# EasyEDA schematic SCH_FSAE_PUPR_EVA34_2026-05-27.json

## Sheets
1 Connector: TITLE: Sheet_1; REV: 1.0; Date: 2025-11-17; Sheet: 1/1; Drawn By: Norman Alphaspeed; Company: Your Company
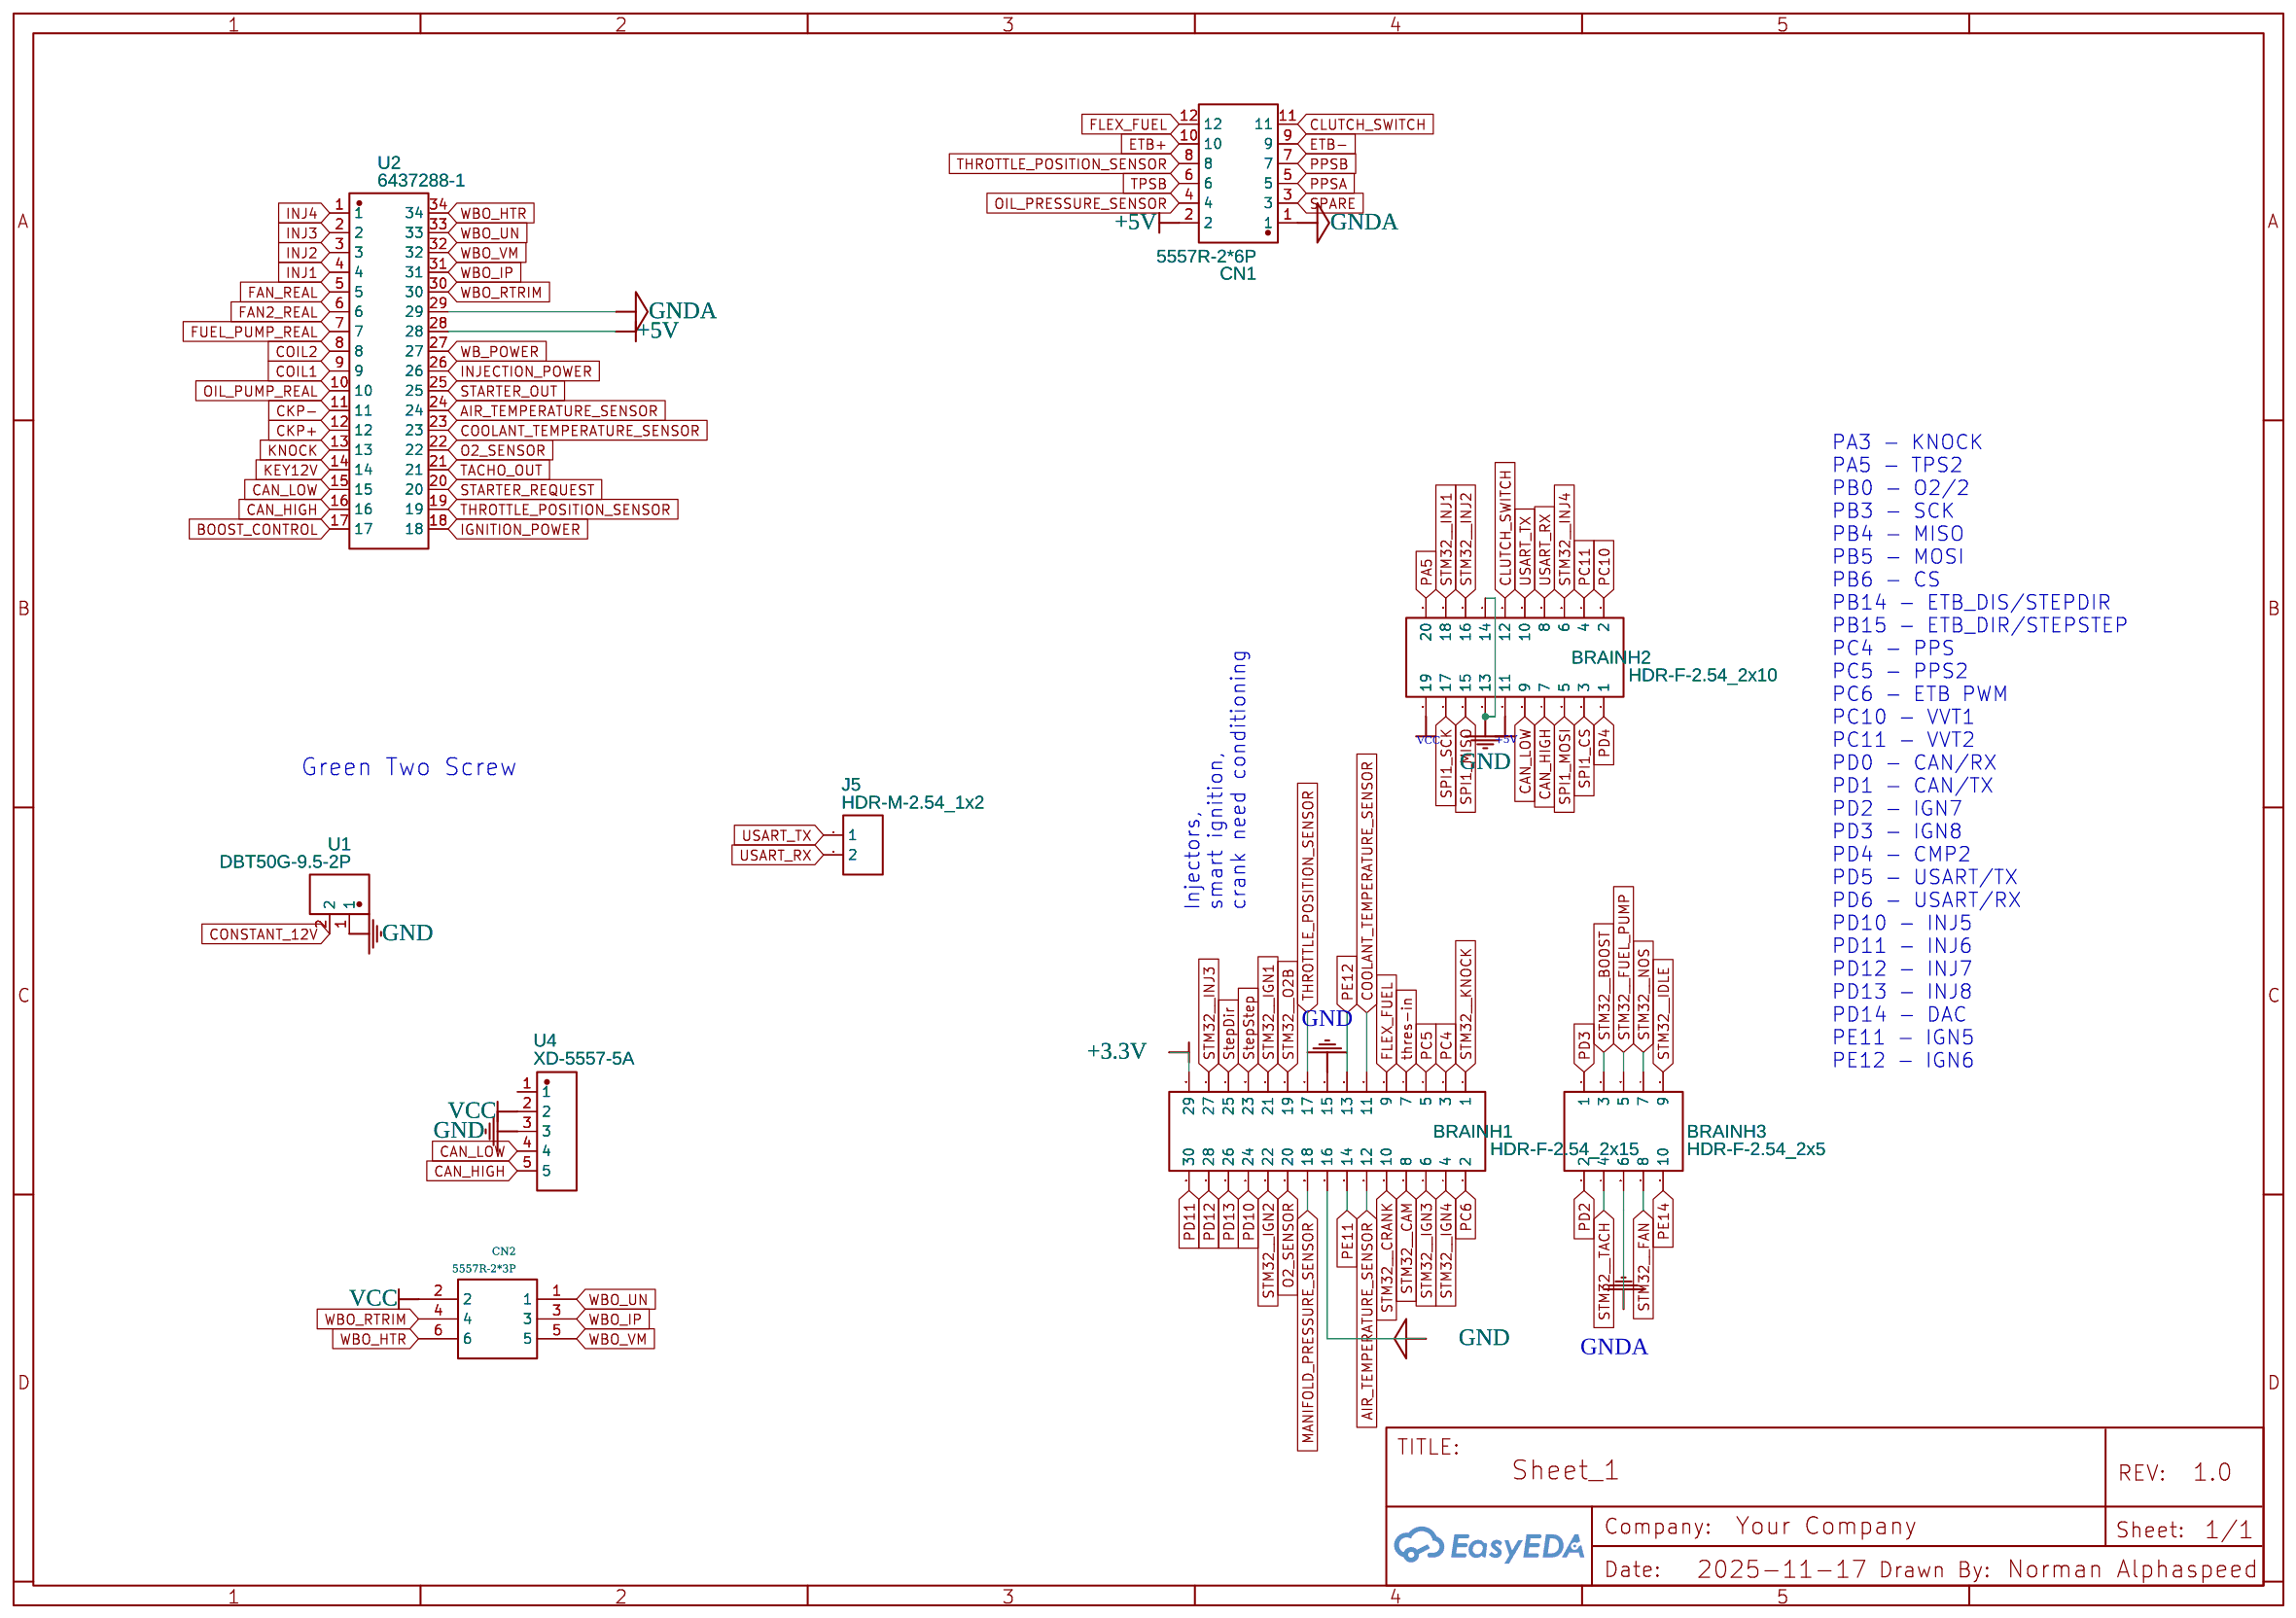
[diagram p0: Connector]
2 Onboard Relays: Date: 2025-11-18
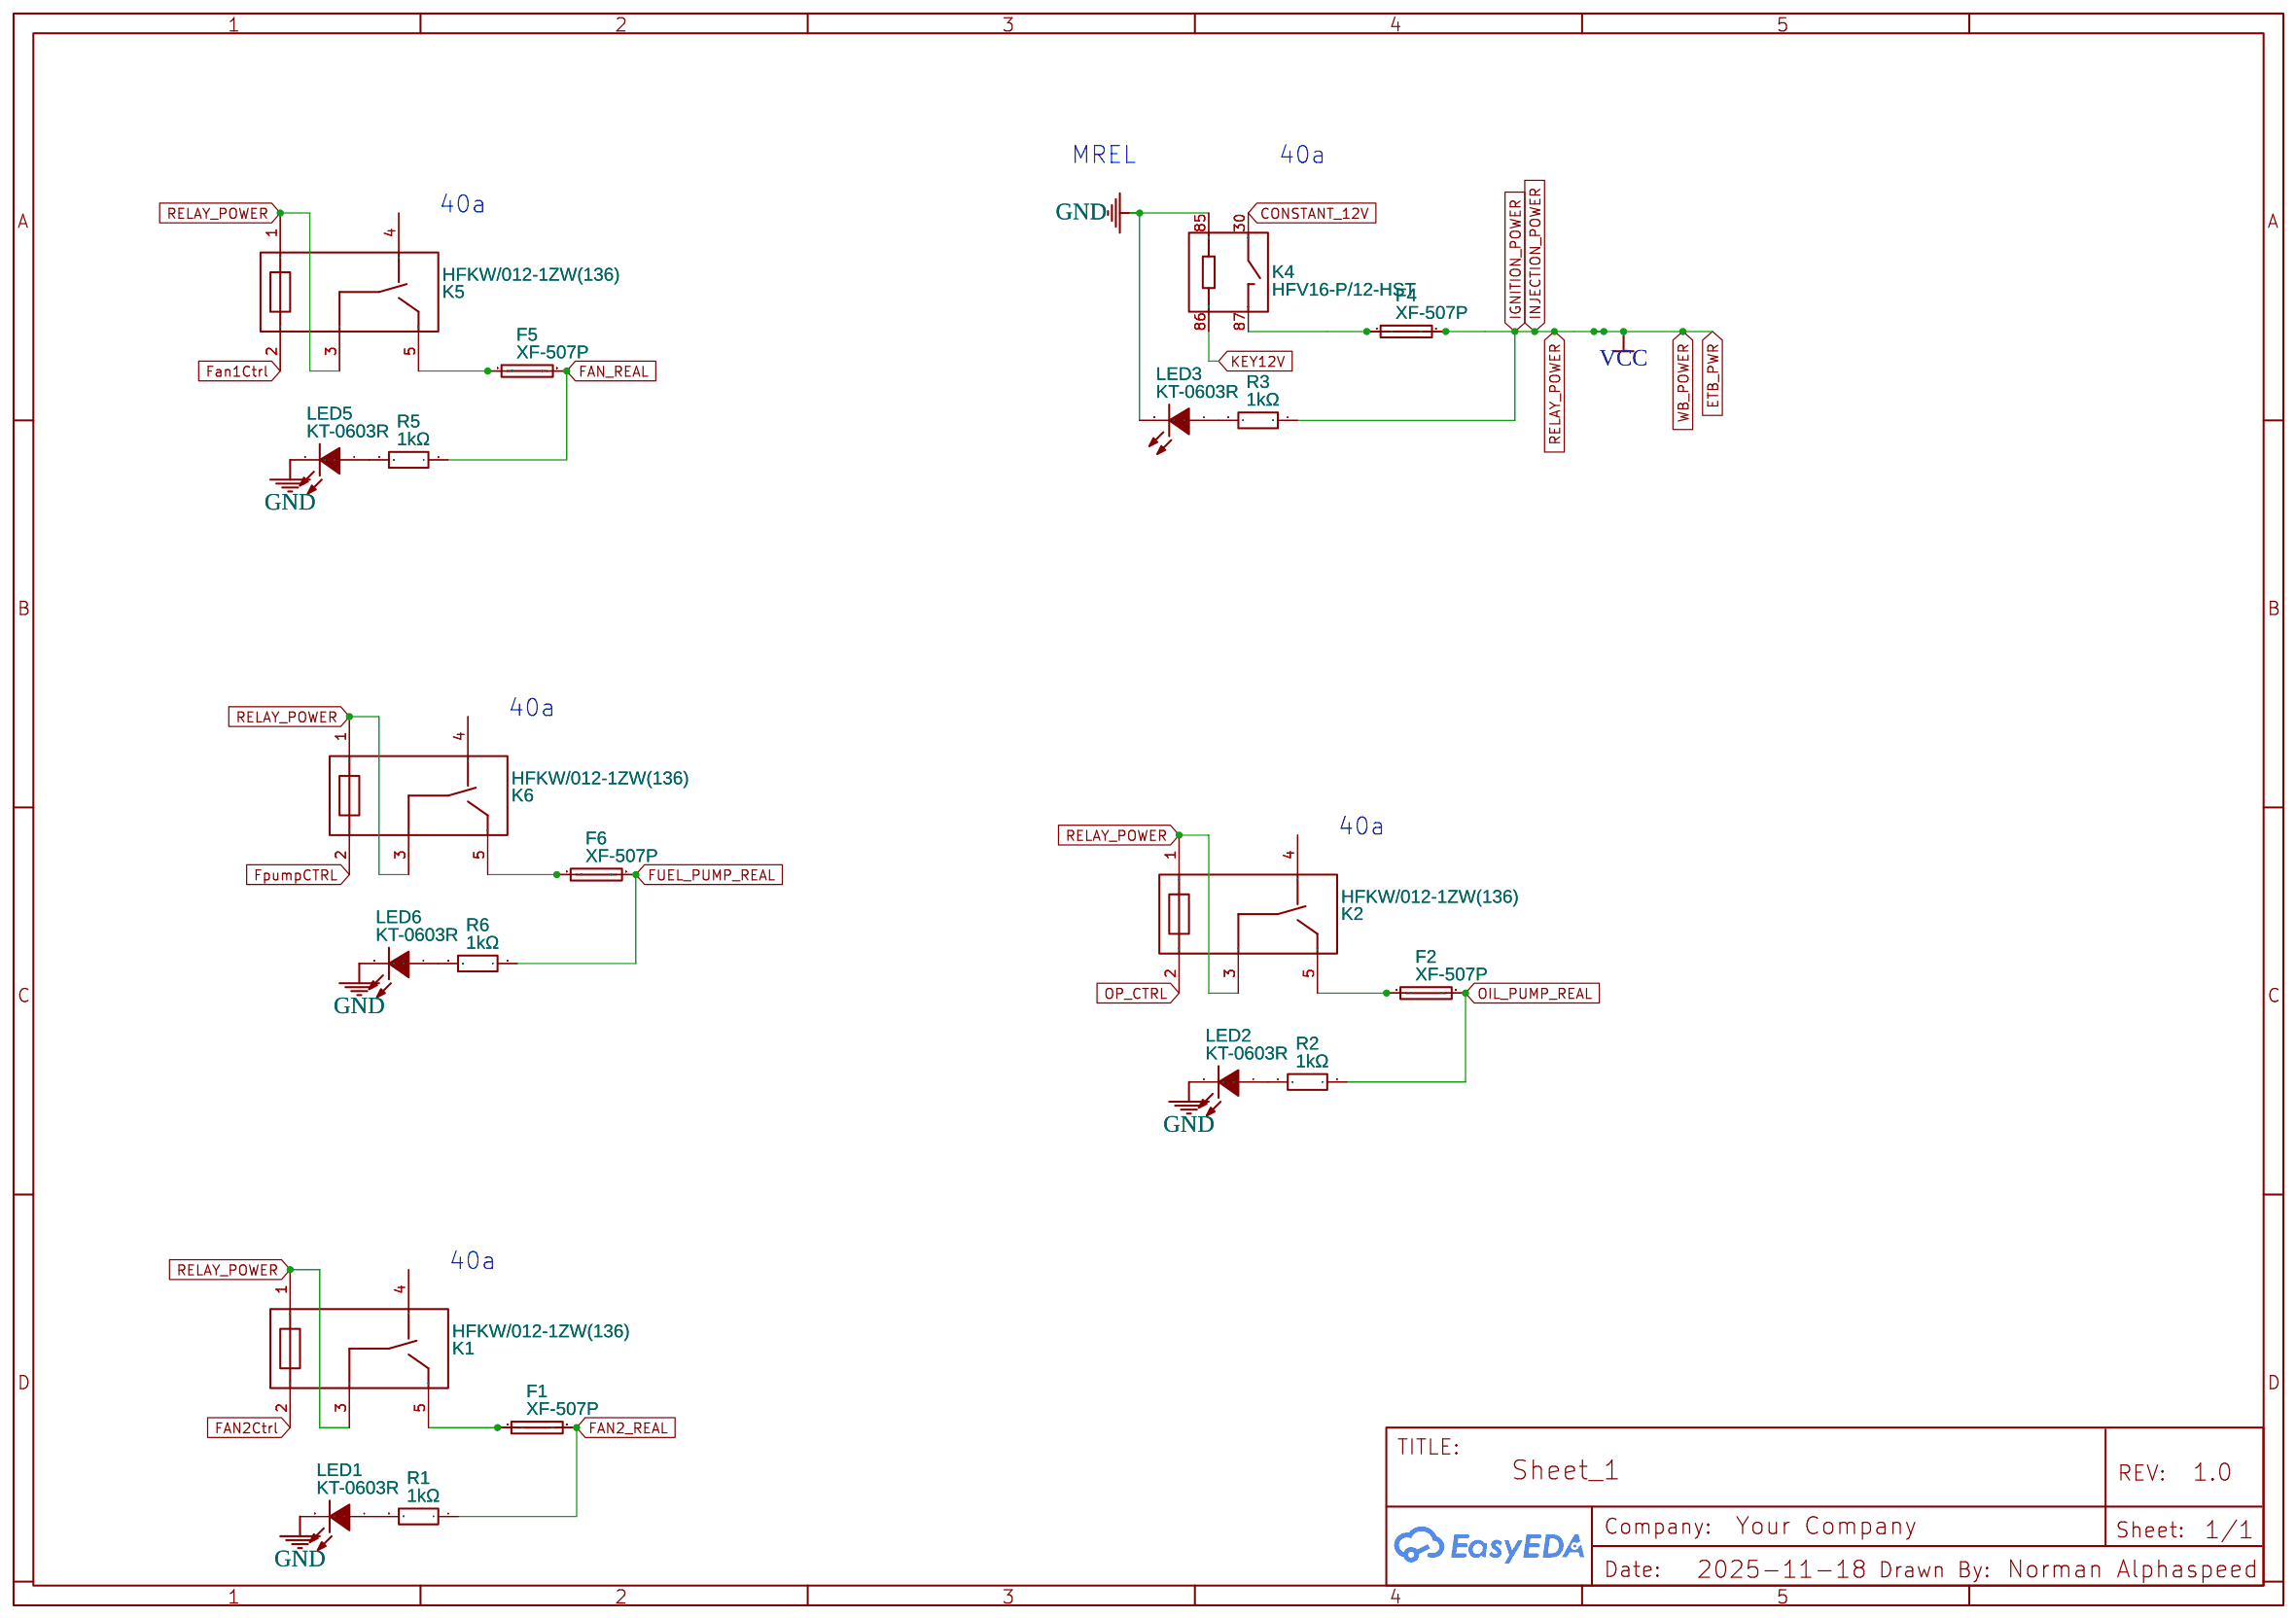
[diagram p1: Onboard Relays]
3 Coils: Date: 2025-11-18
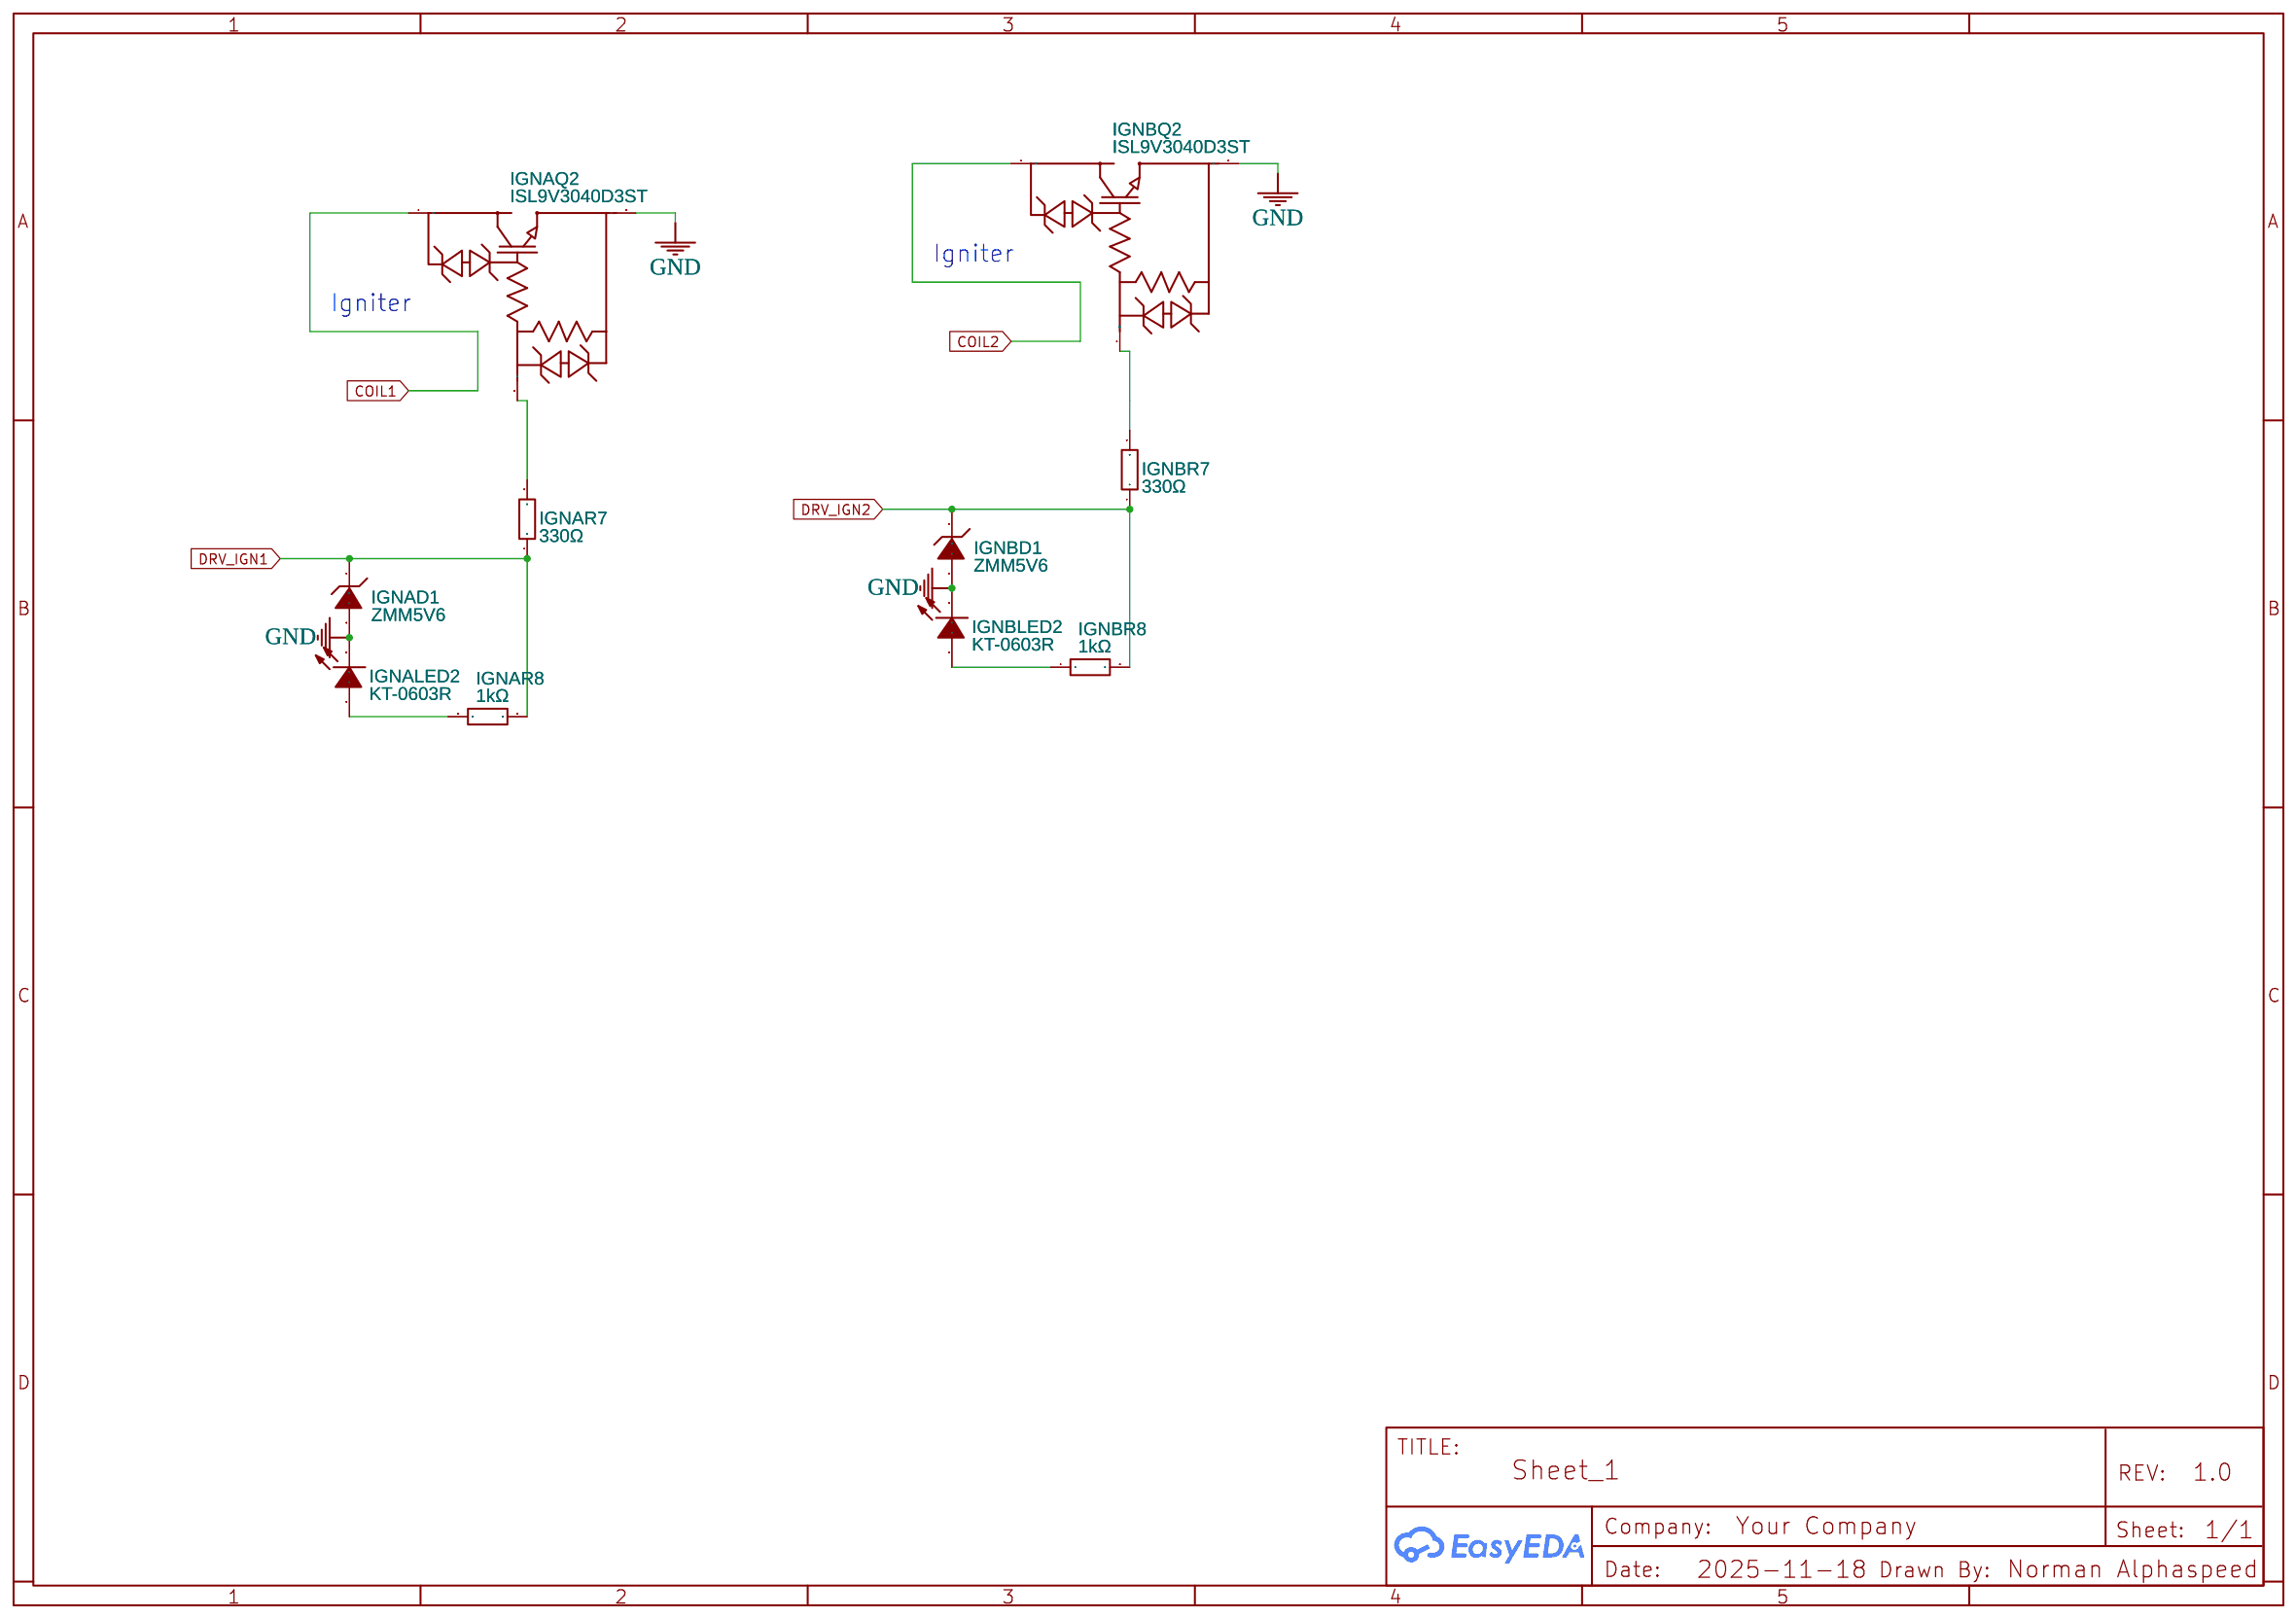
[diagram p2: Coils]
4 Injectors: Date: 2025-11-18
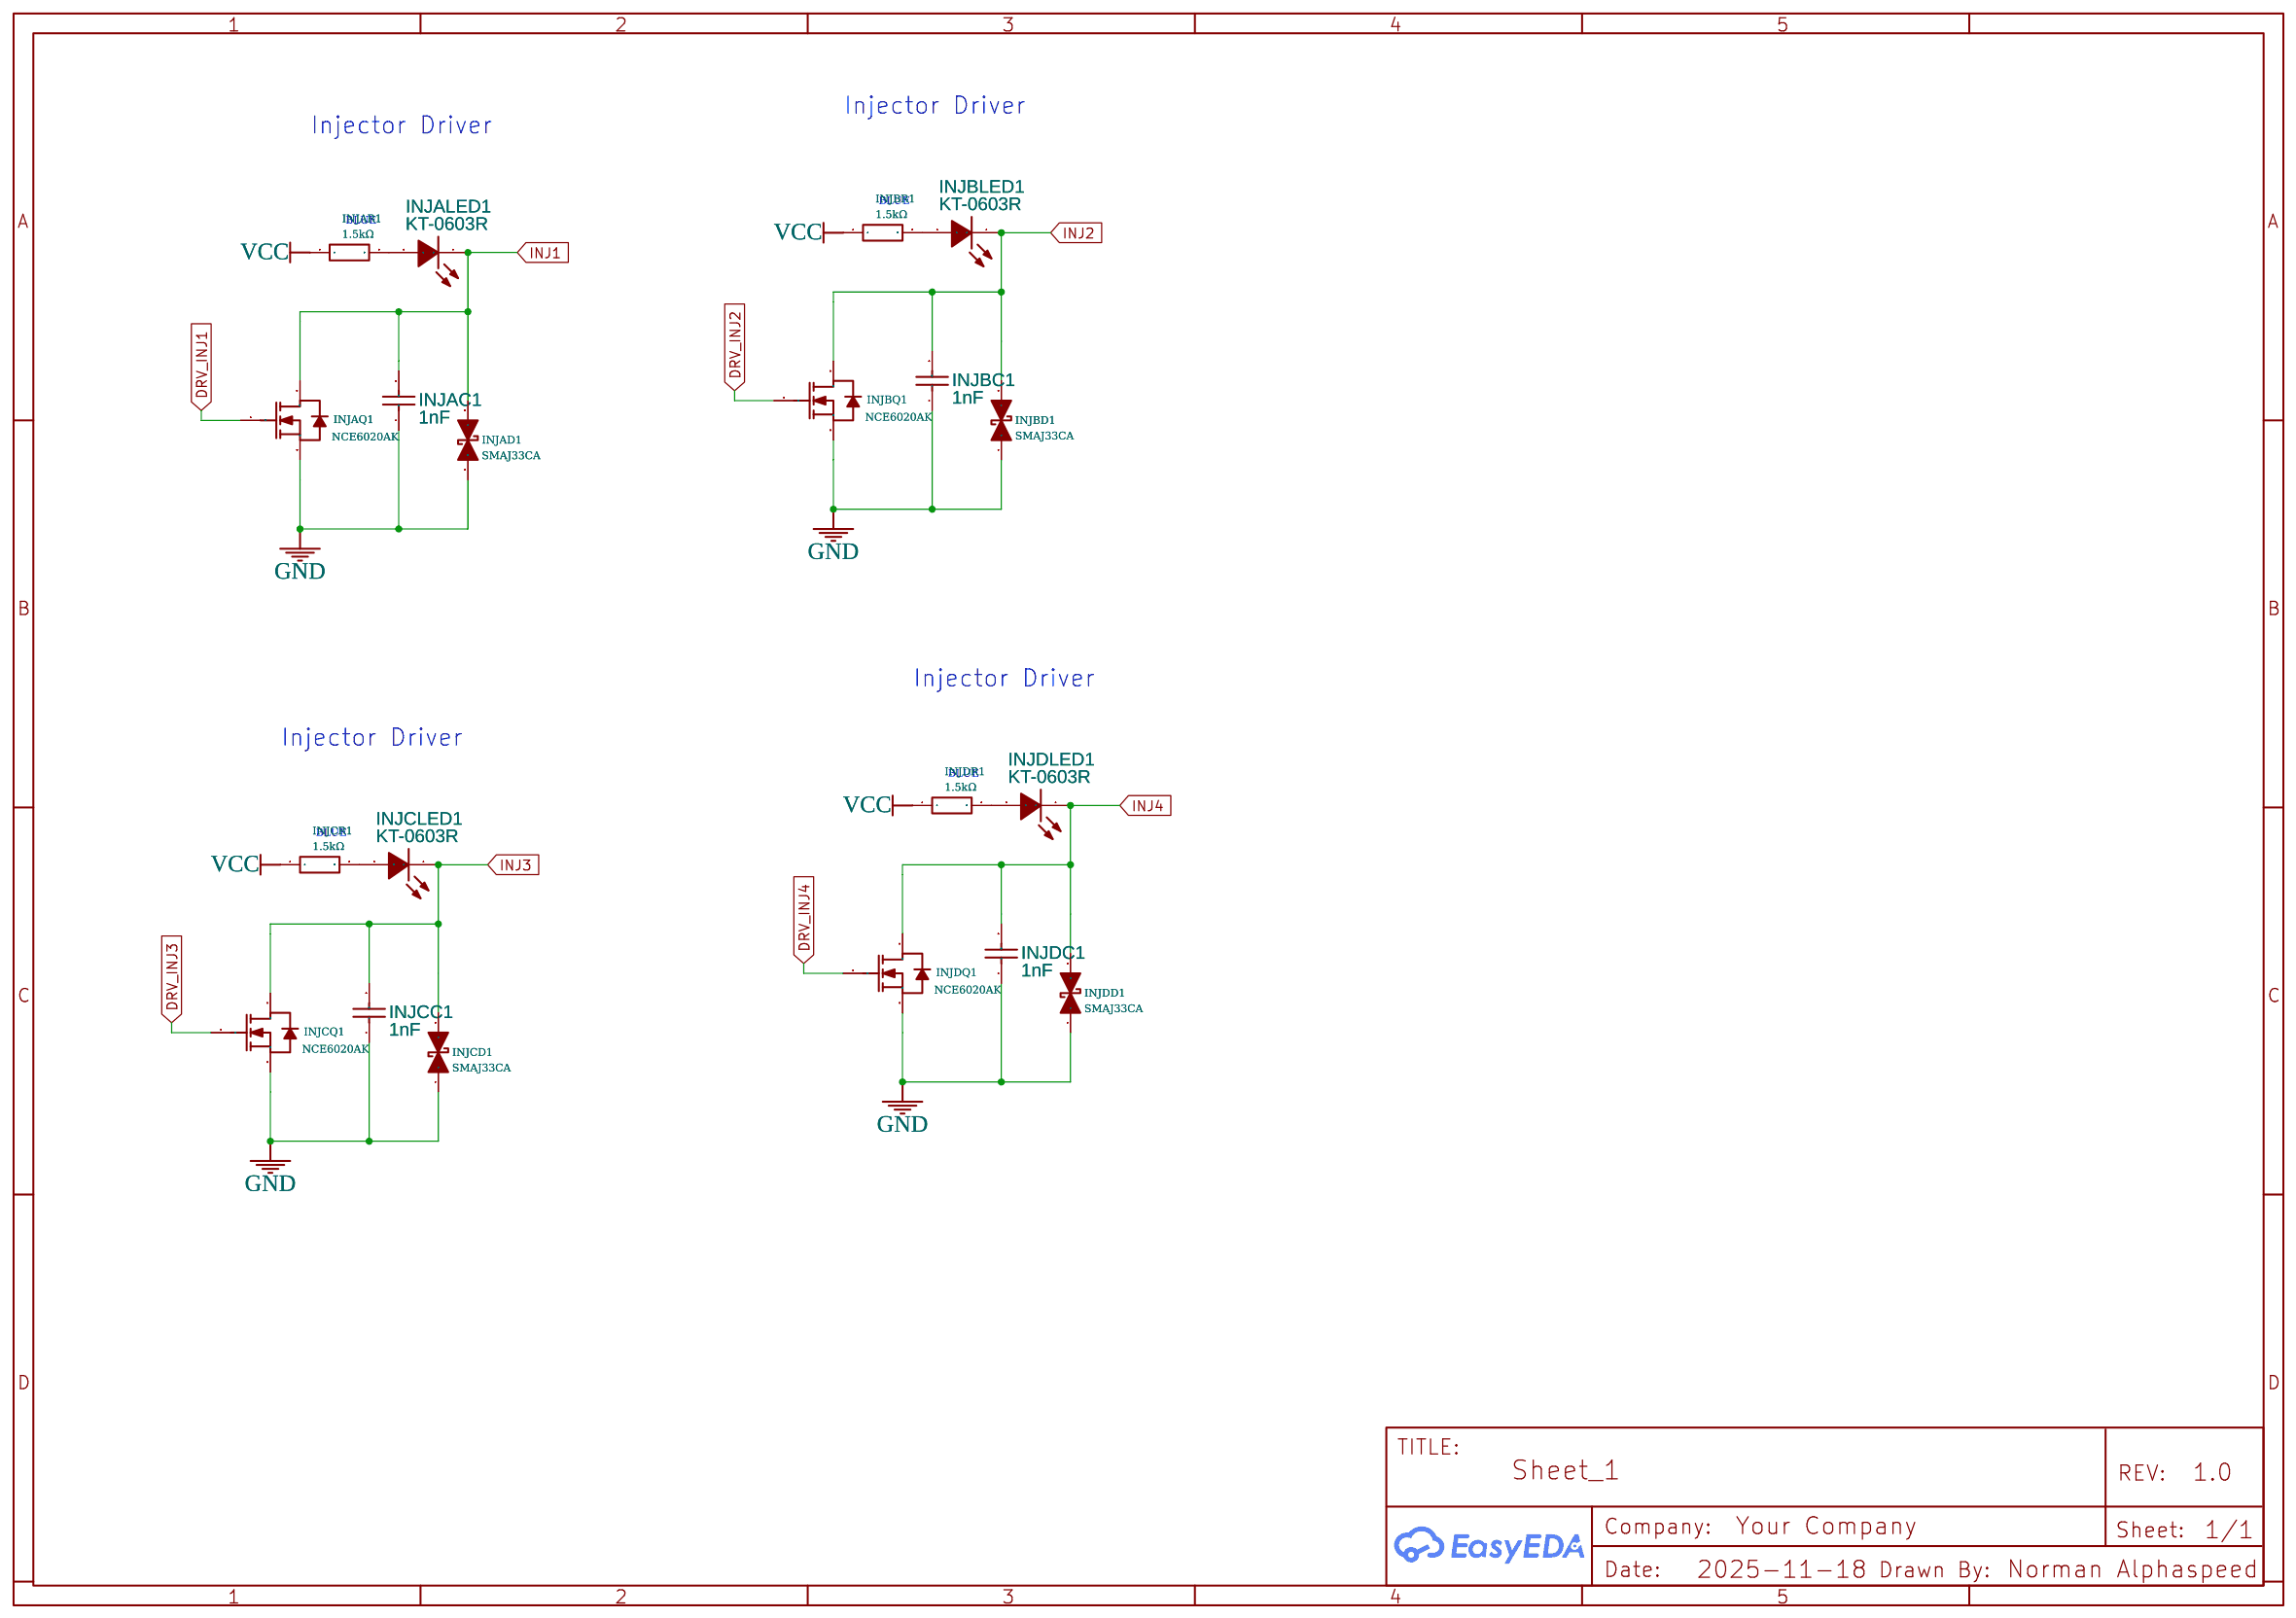
[diagram p3: Injectors]
5 Digital: Date: 2025-11-20
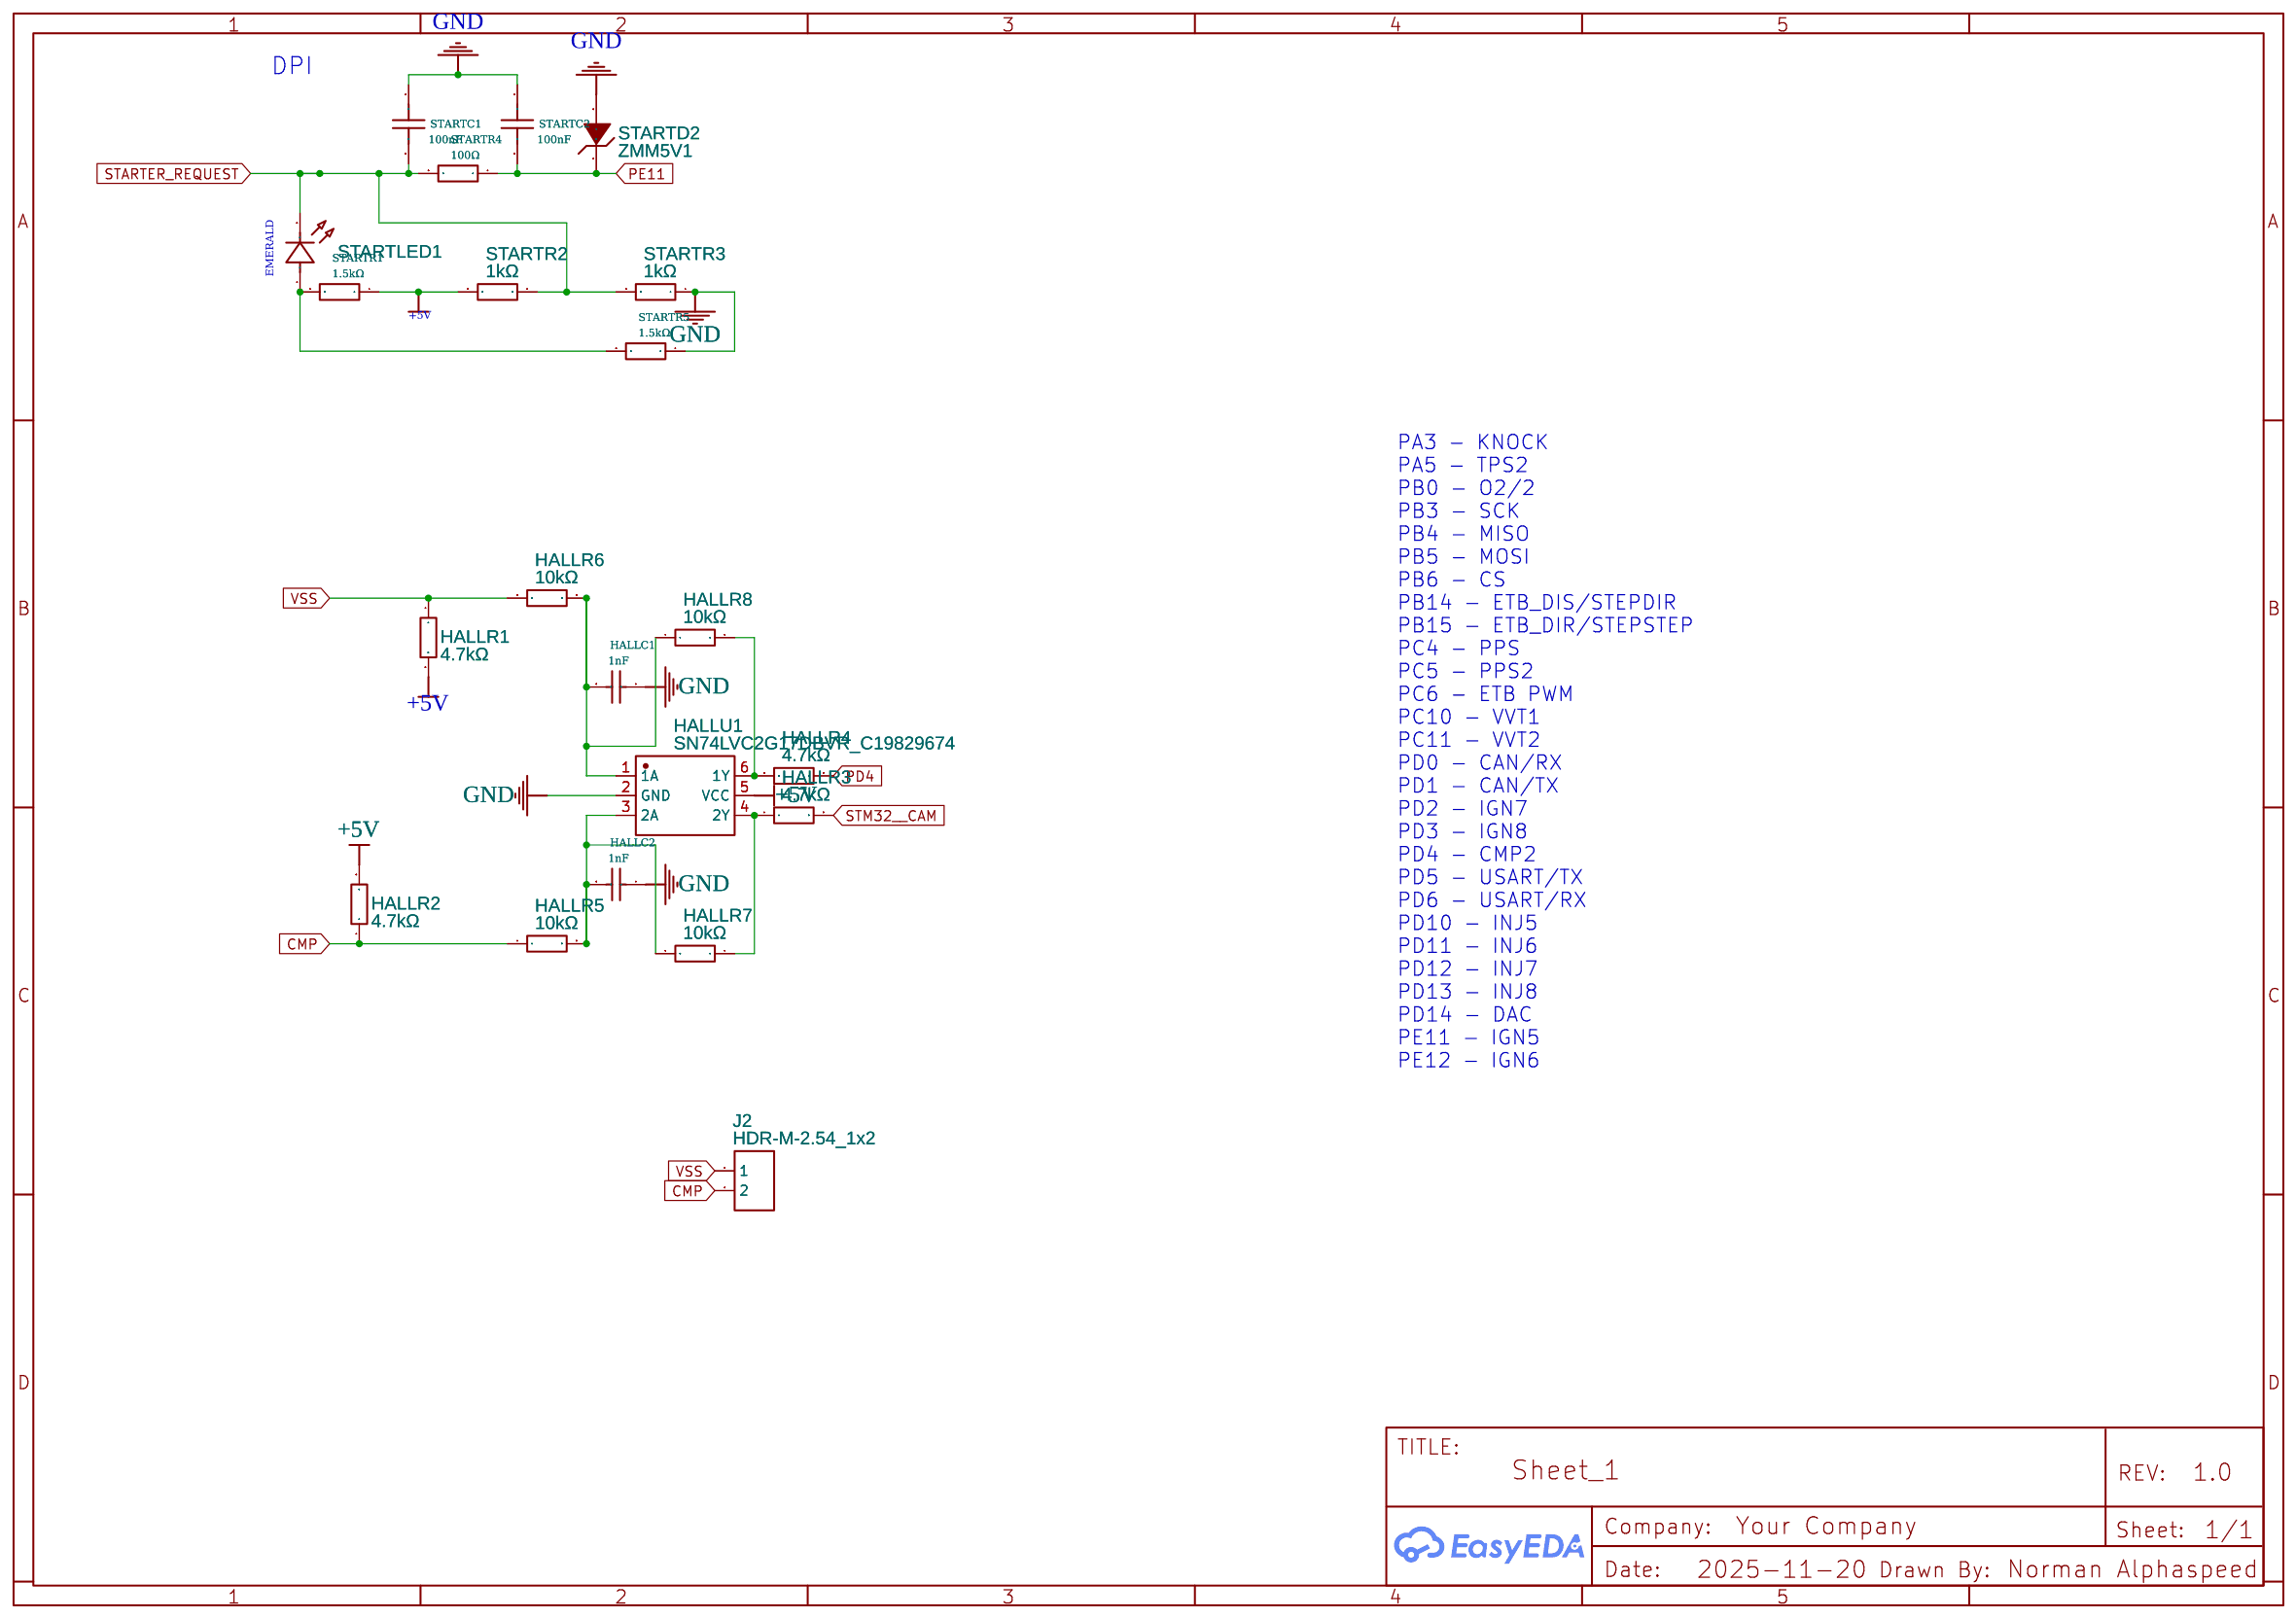
[diagram p4: Digital]
6 Outputs: TITLE: Sheet_2; Date: 2025-11-20
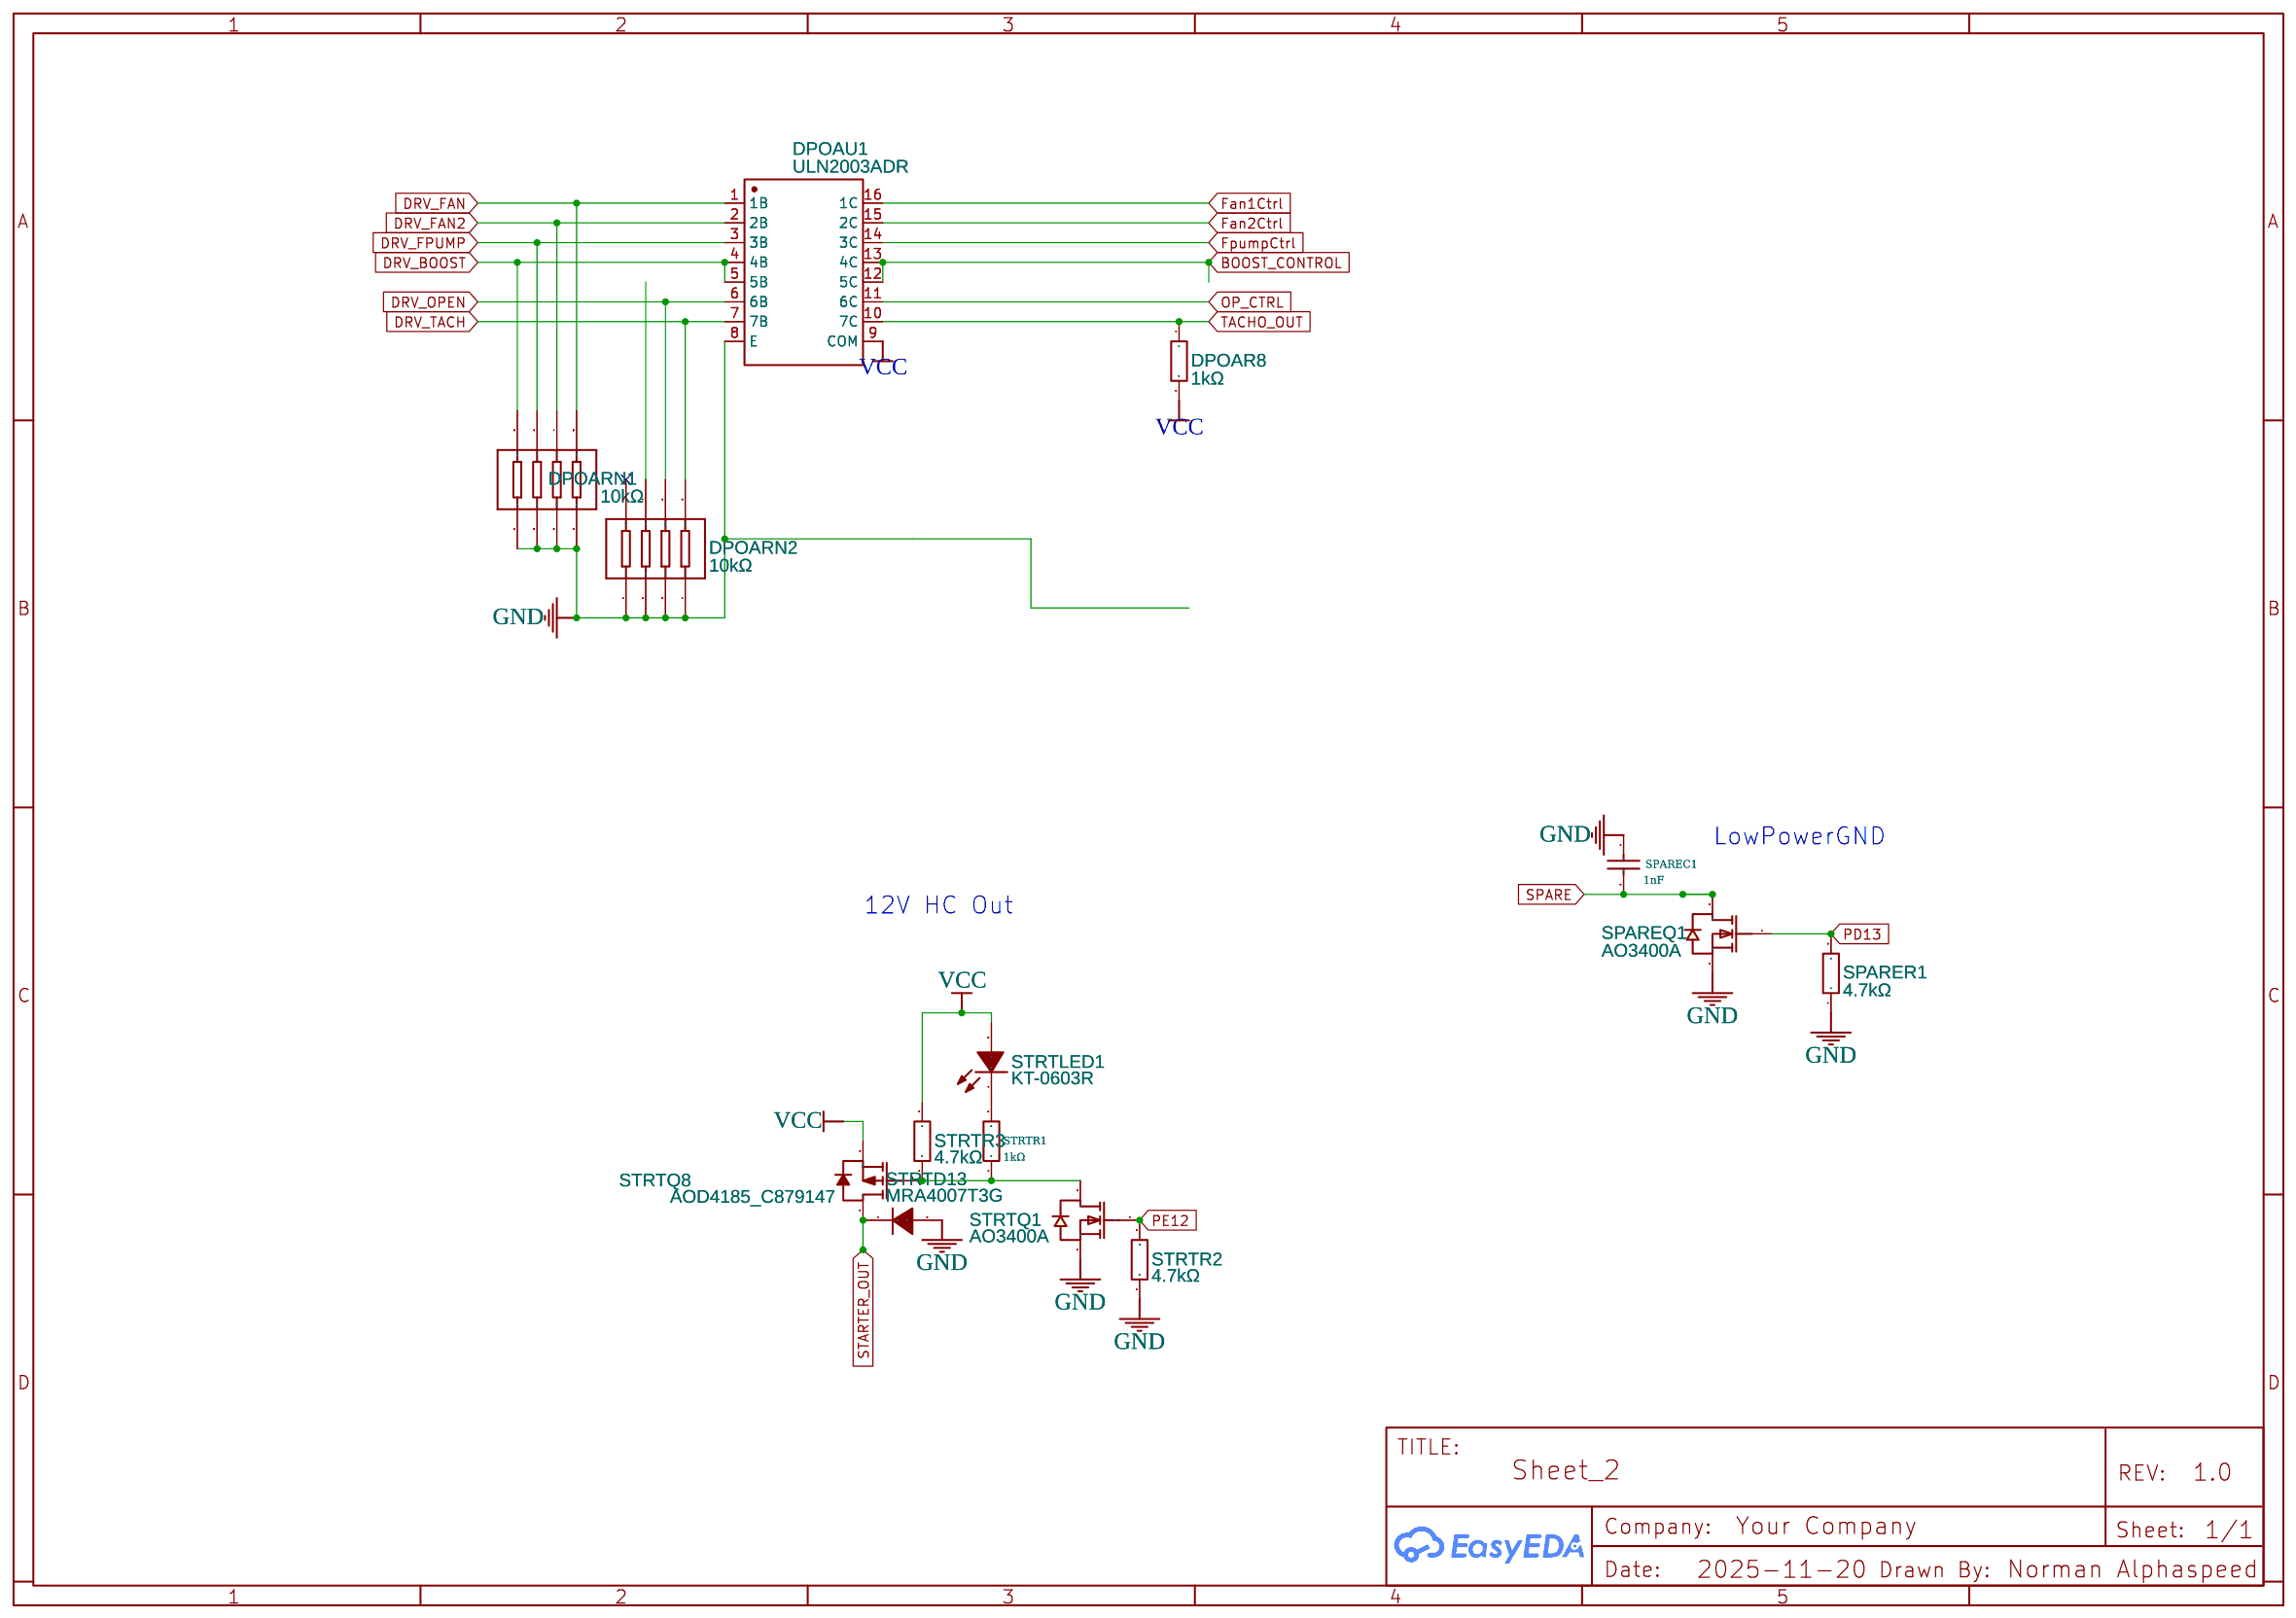
[diagram p5: Outputs]
7 Analog: Date: 2025-11-20
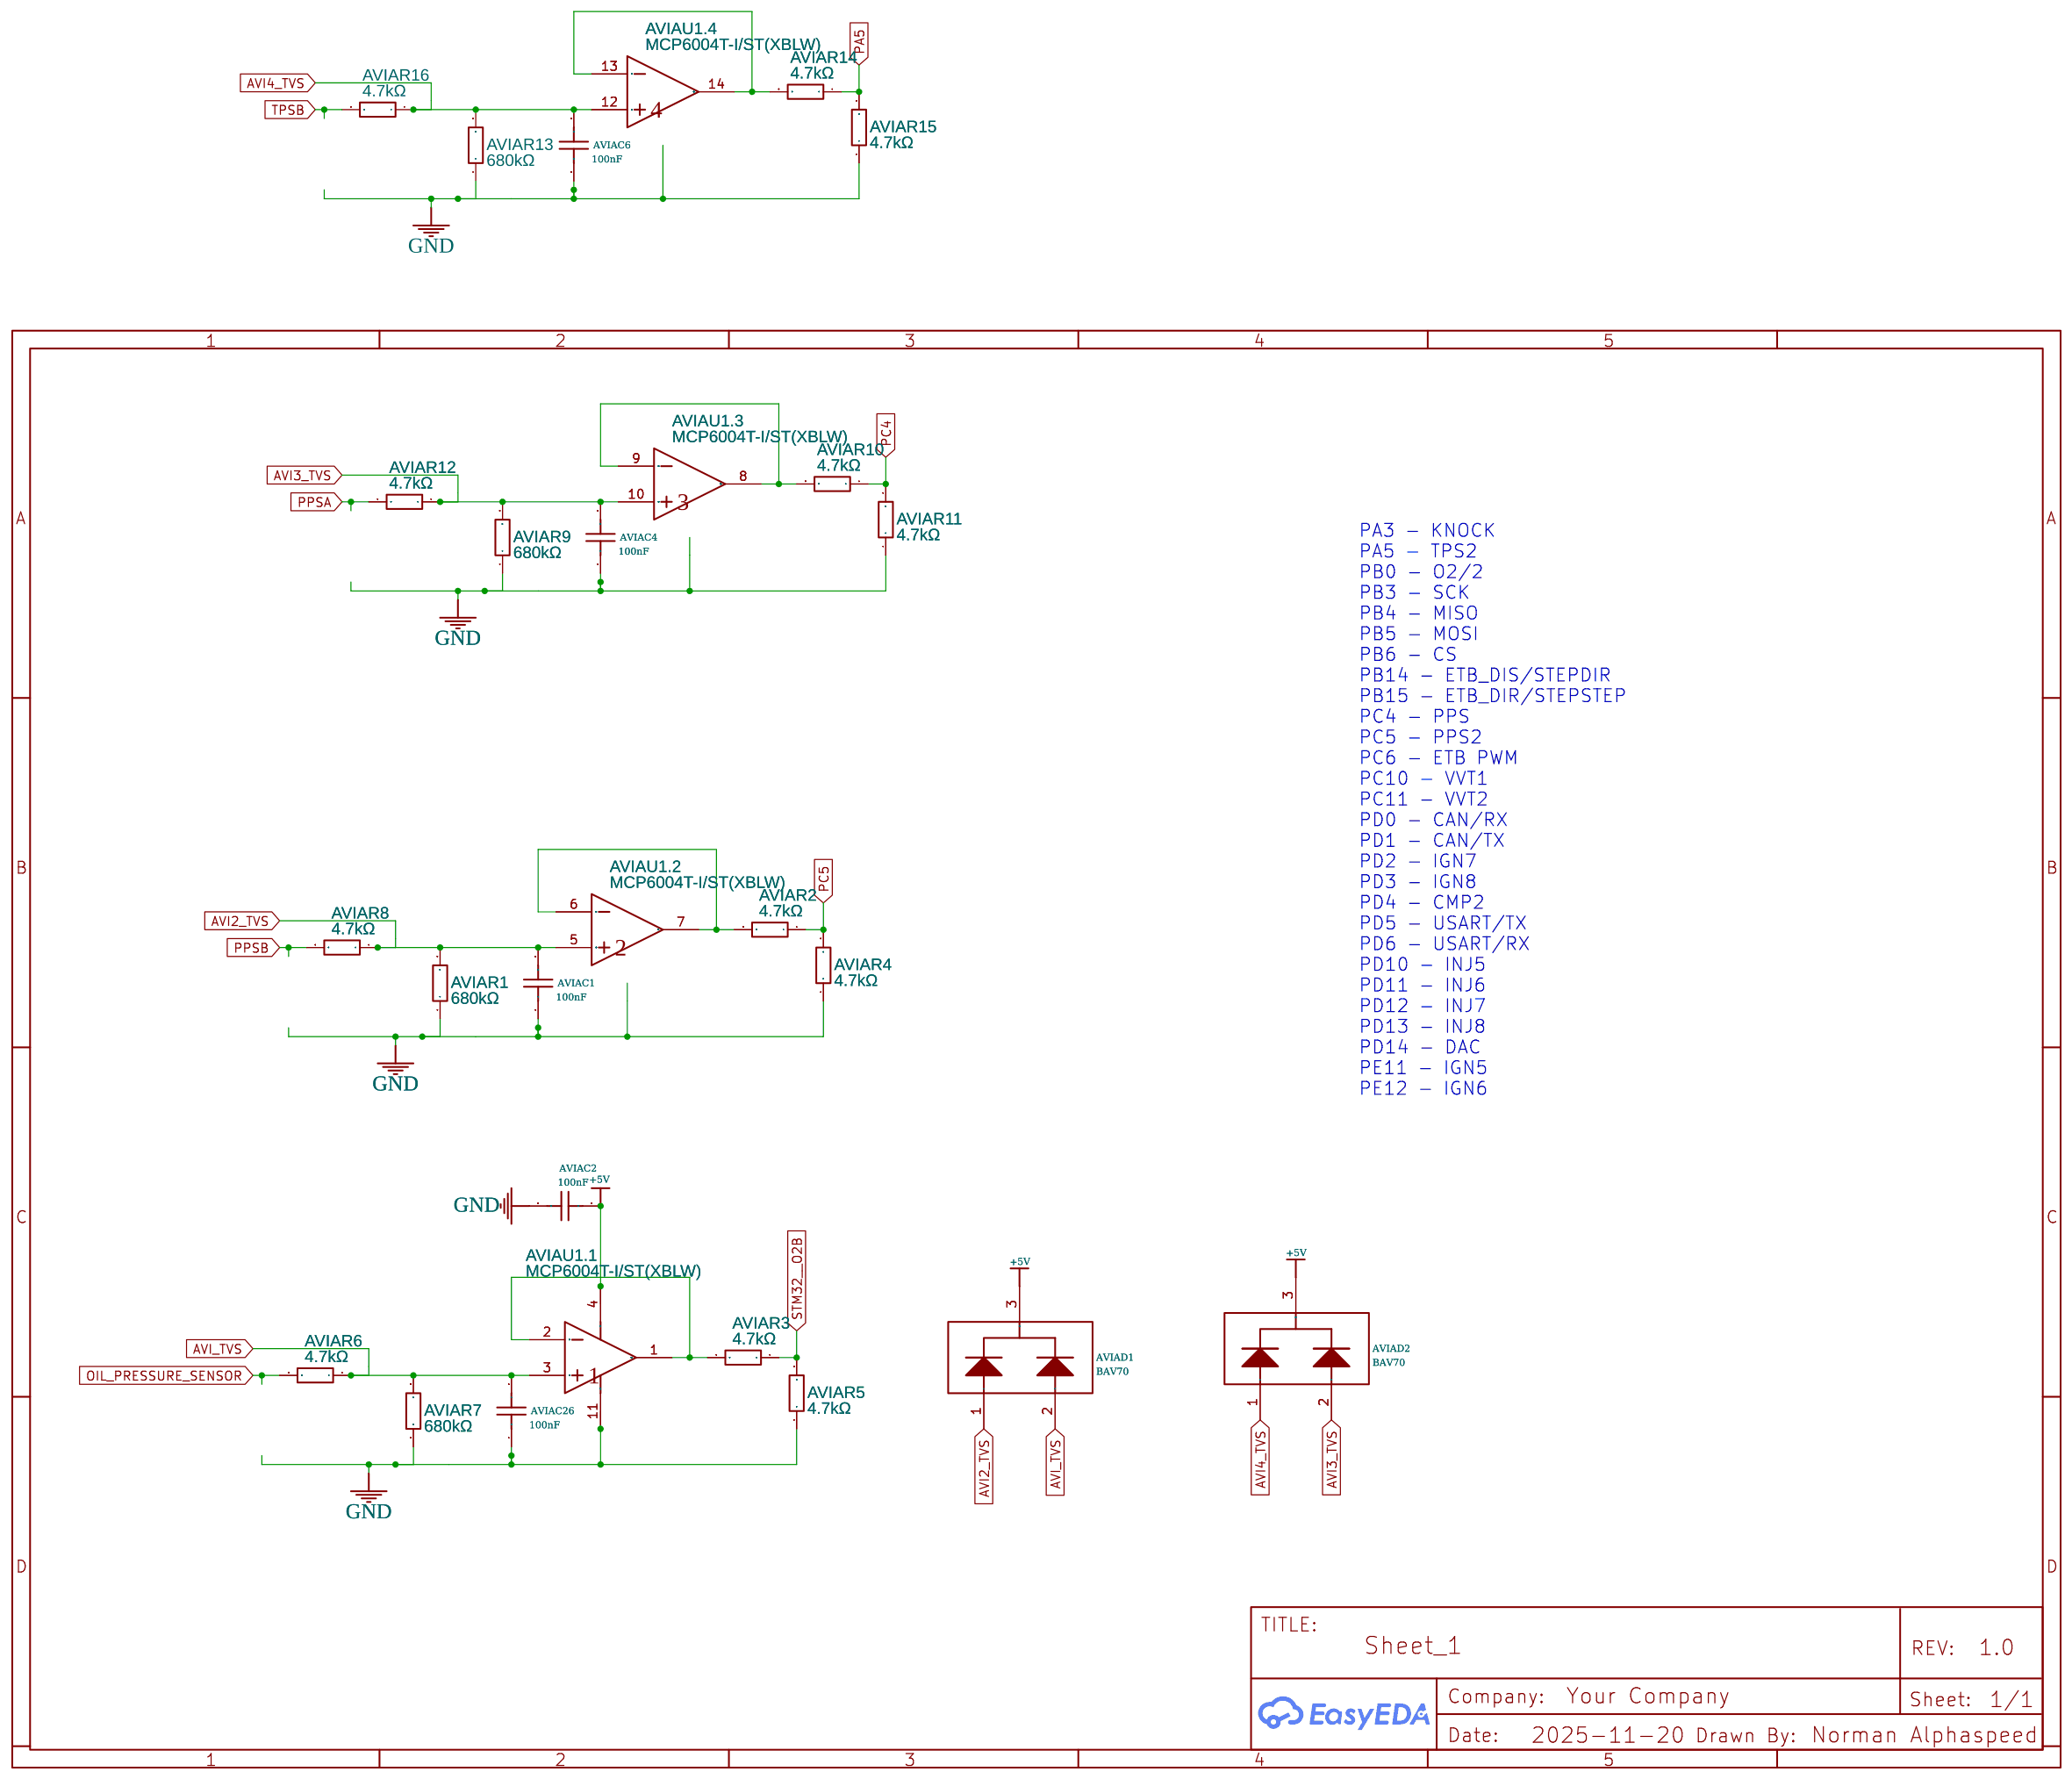
[diagram p6: Analog]
8 Driver: TITLE: Sheet_2; Date: 2025-11-20
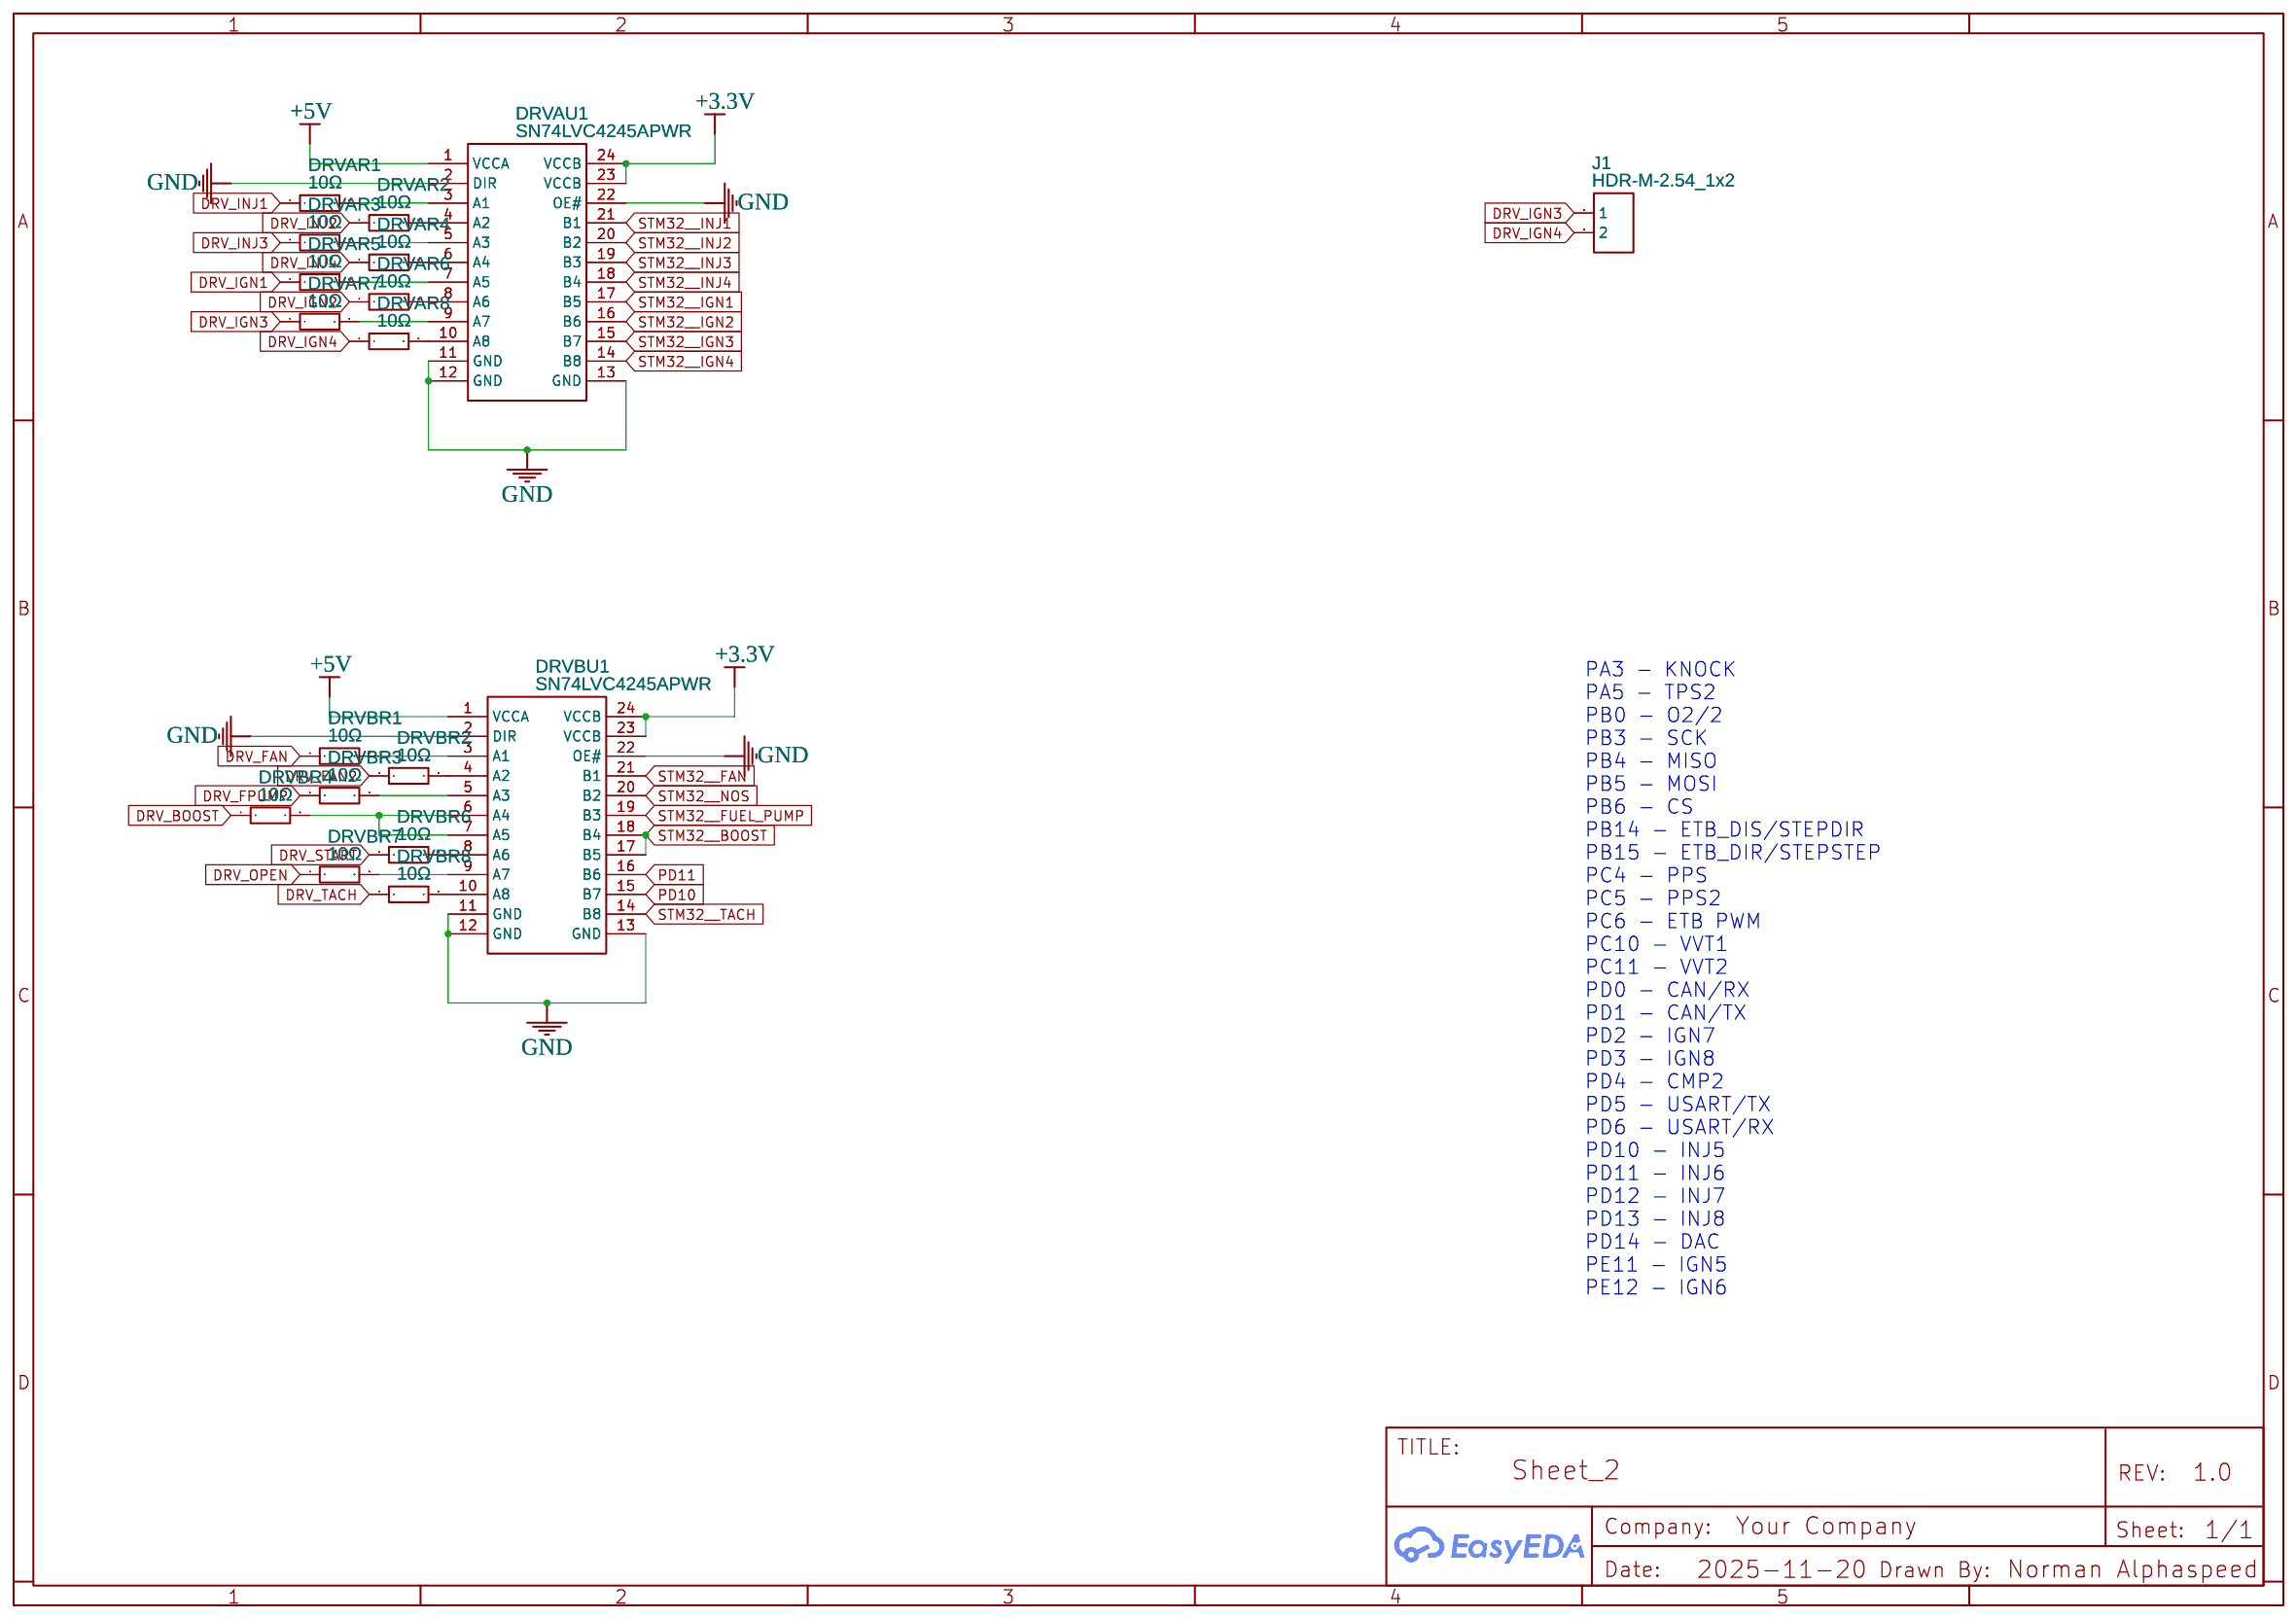
[diagram p7: Driver]
9 CKP: Date: 2025-11-20
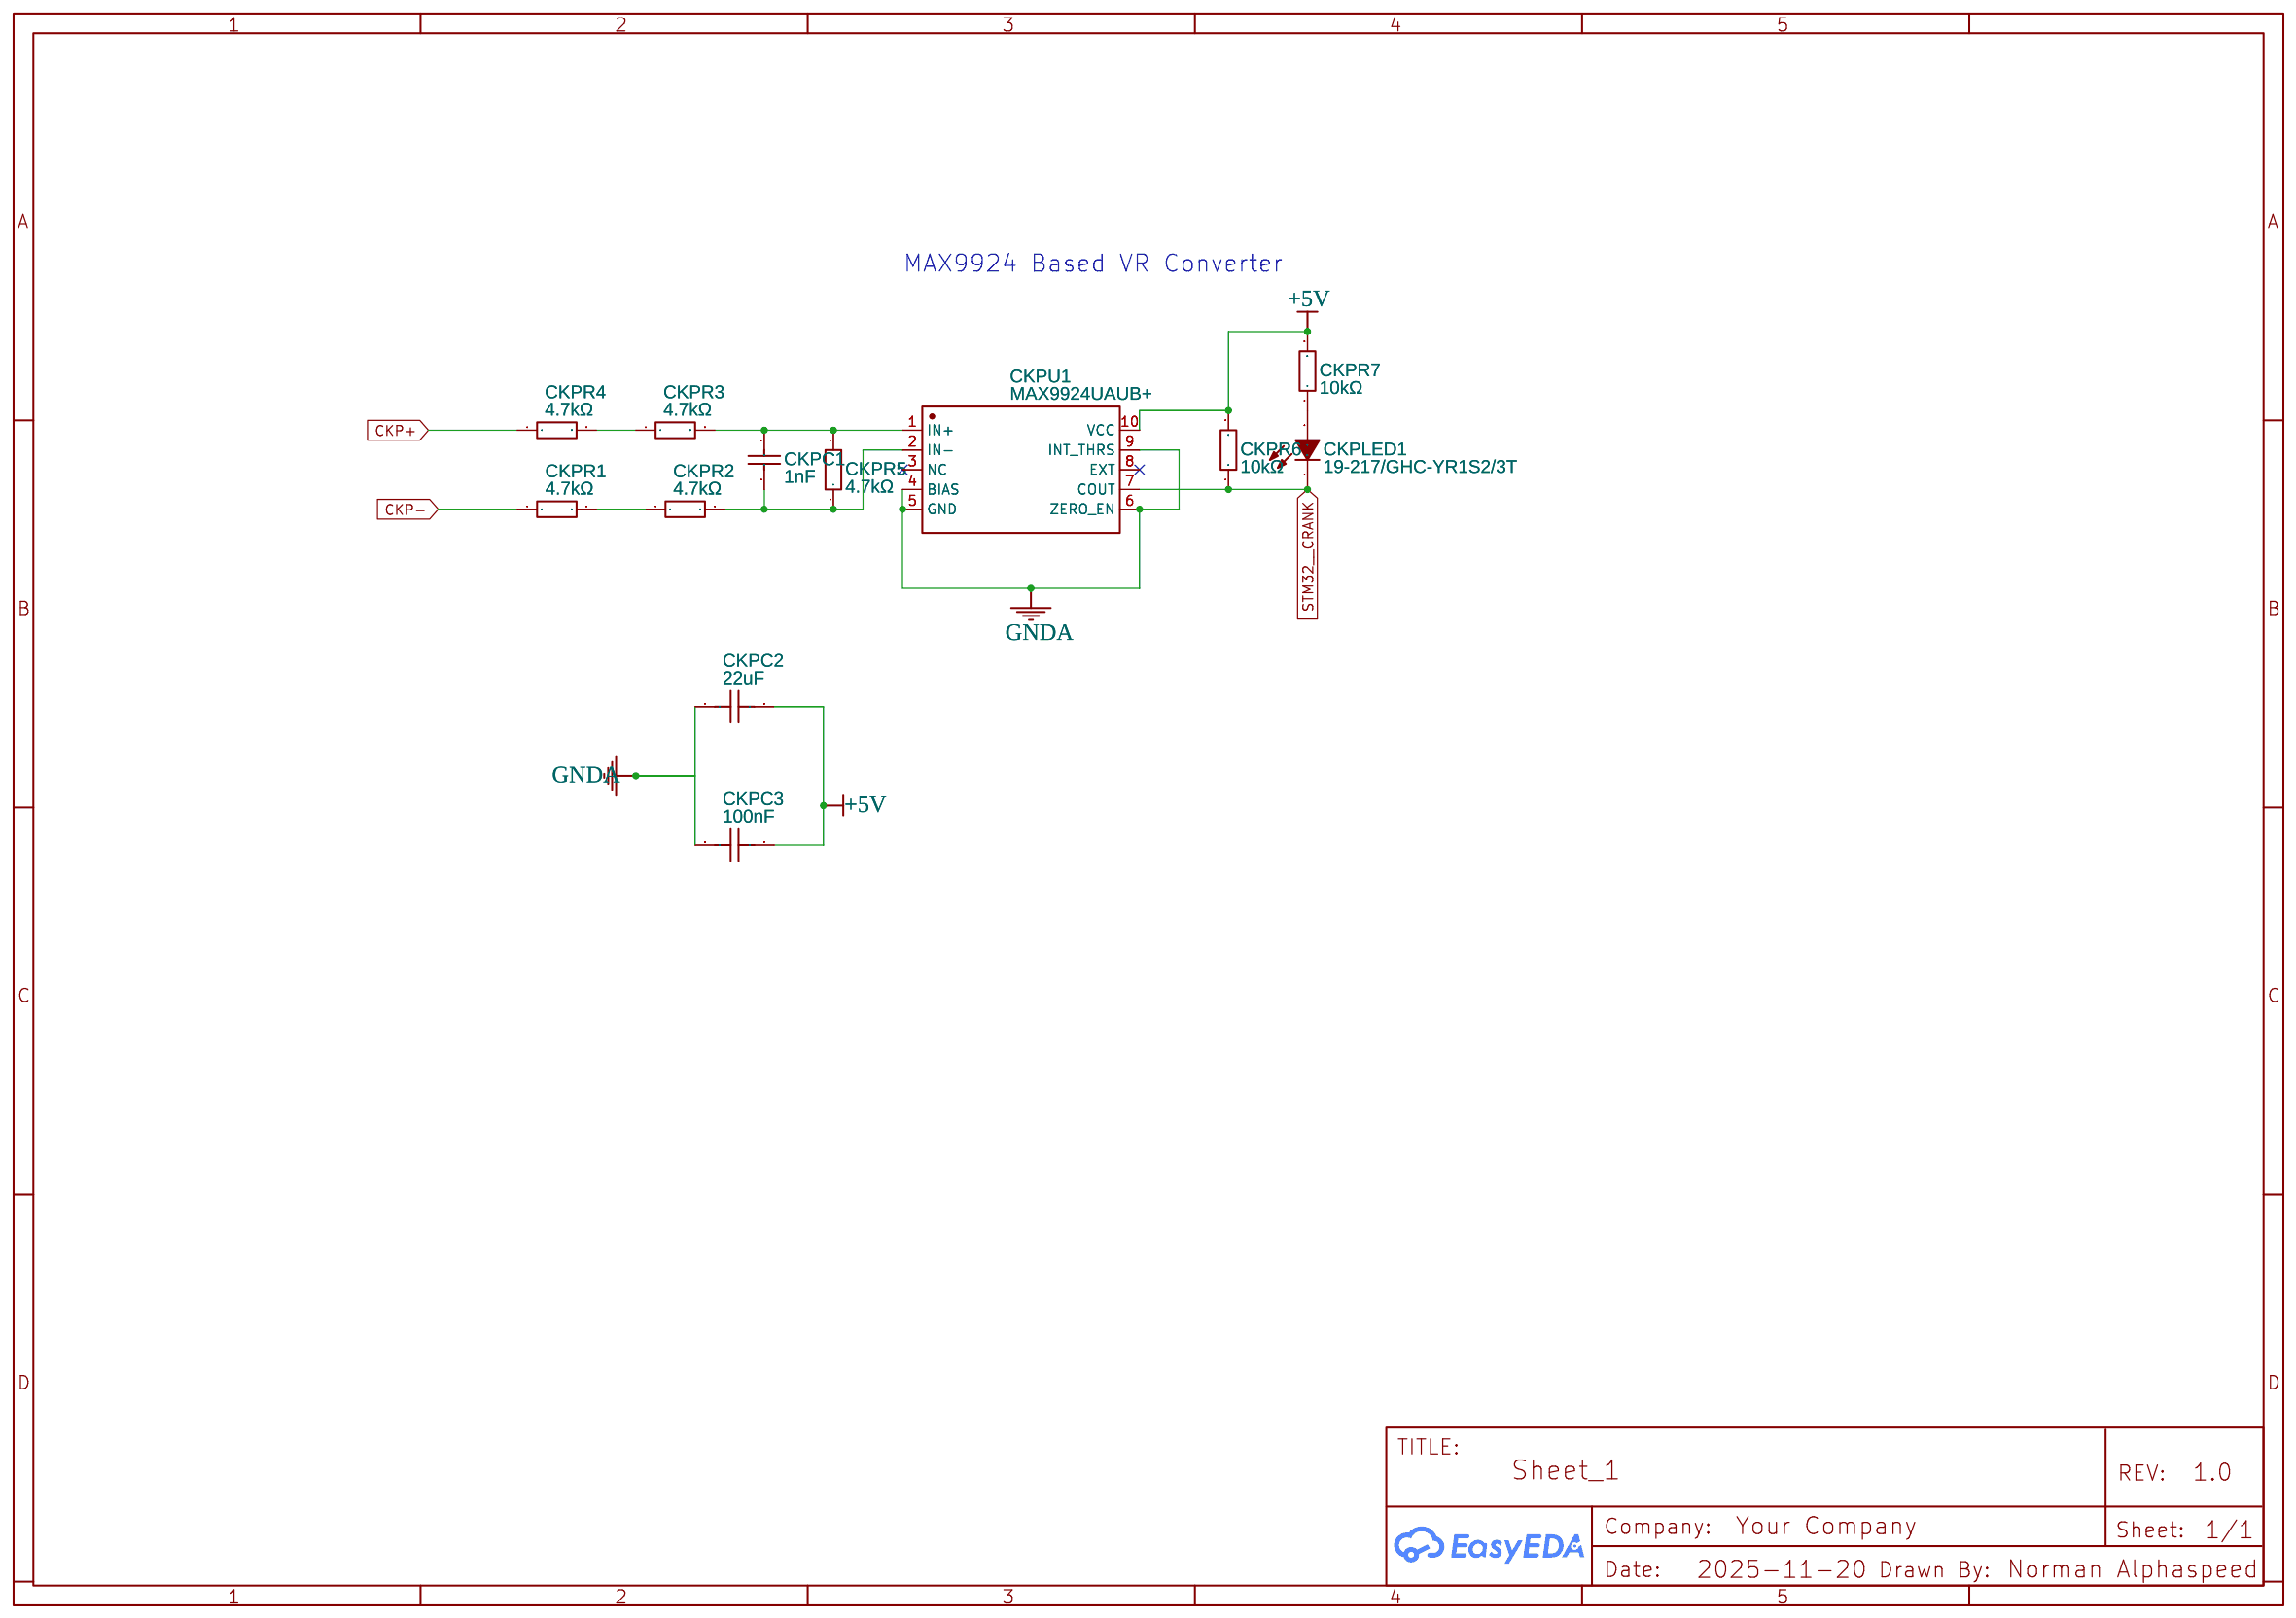
[diagram p8: CKP]
10 MAP: Date: 2025-11-20
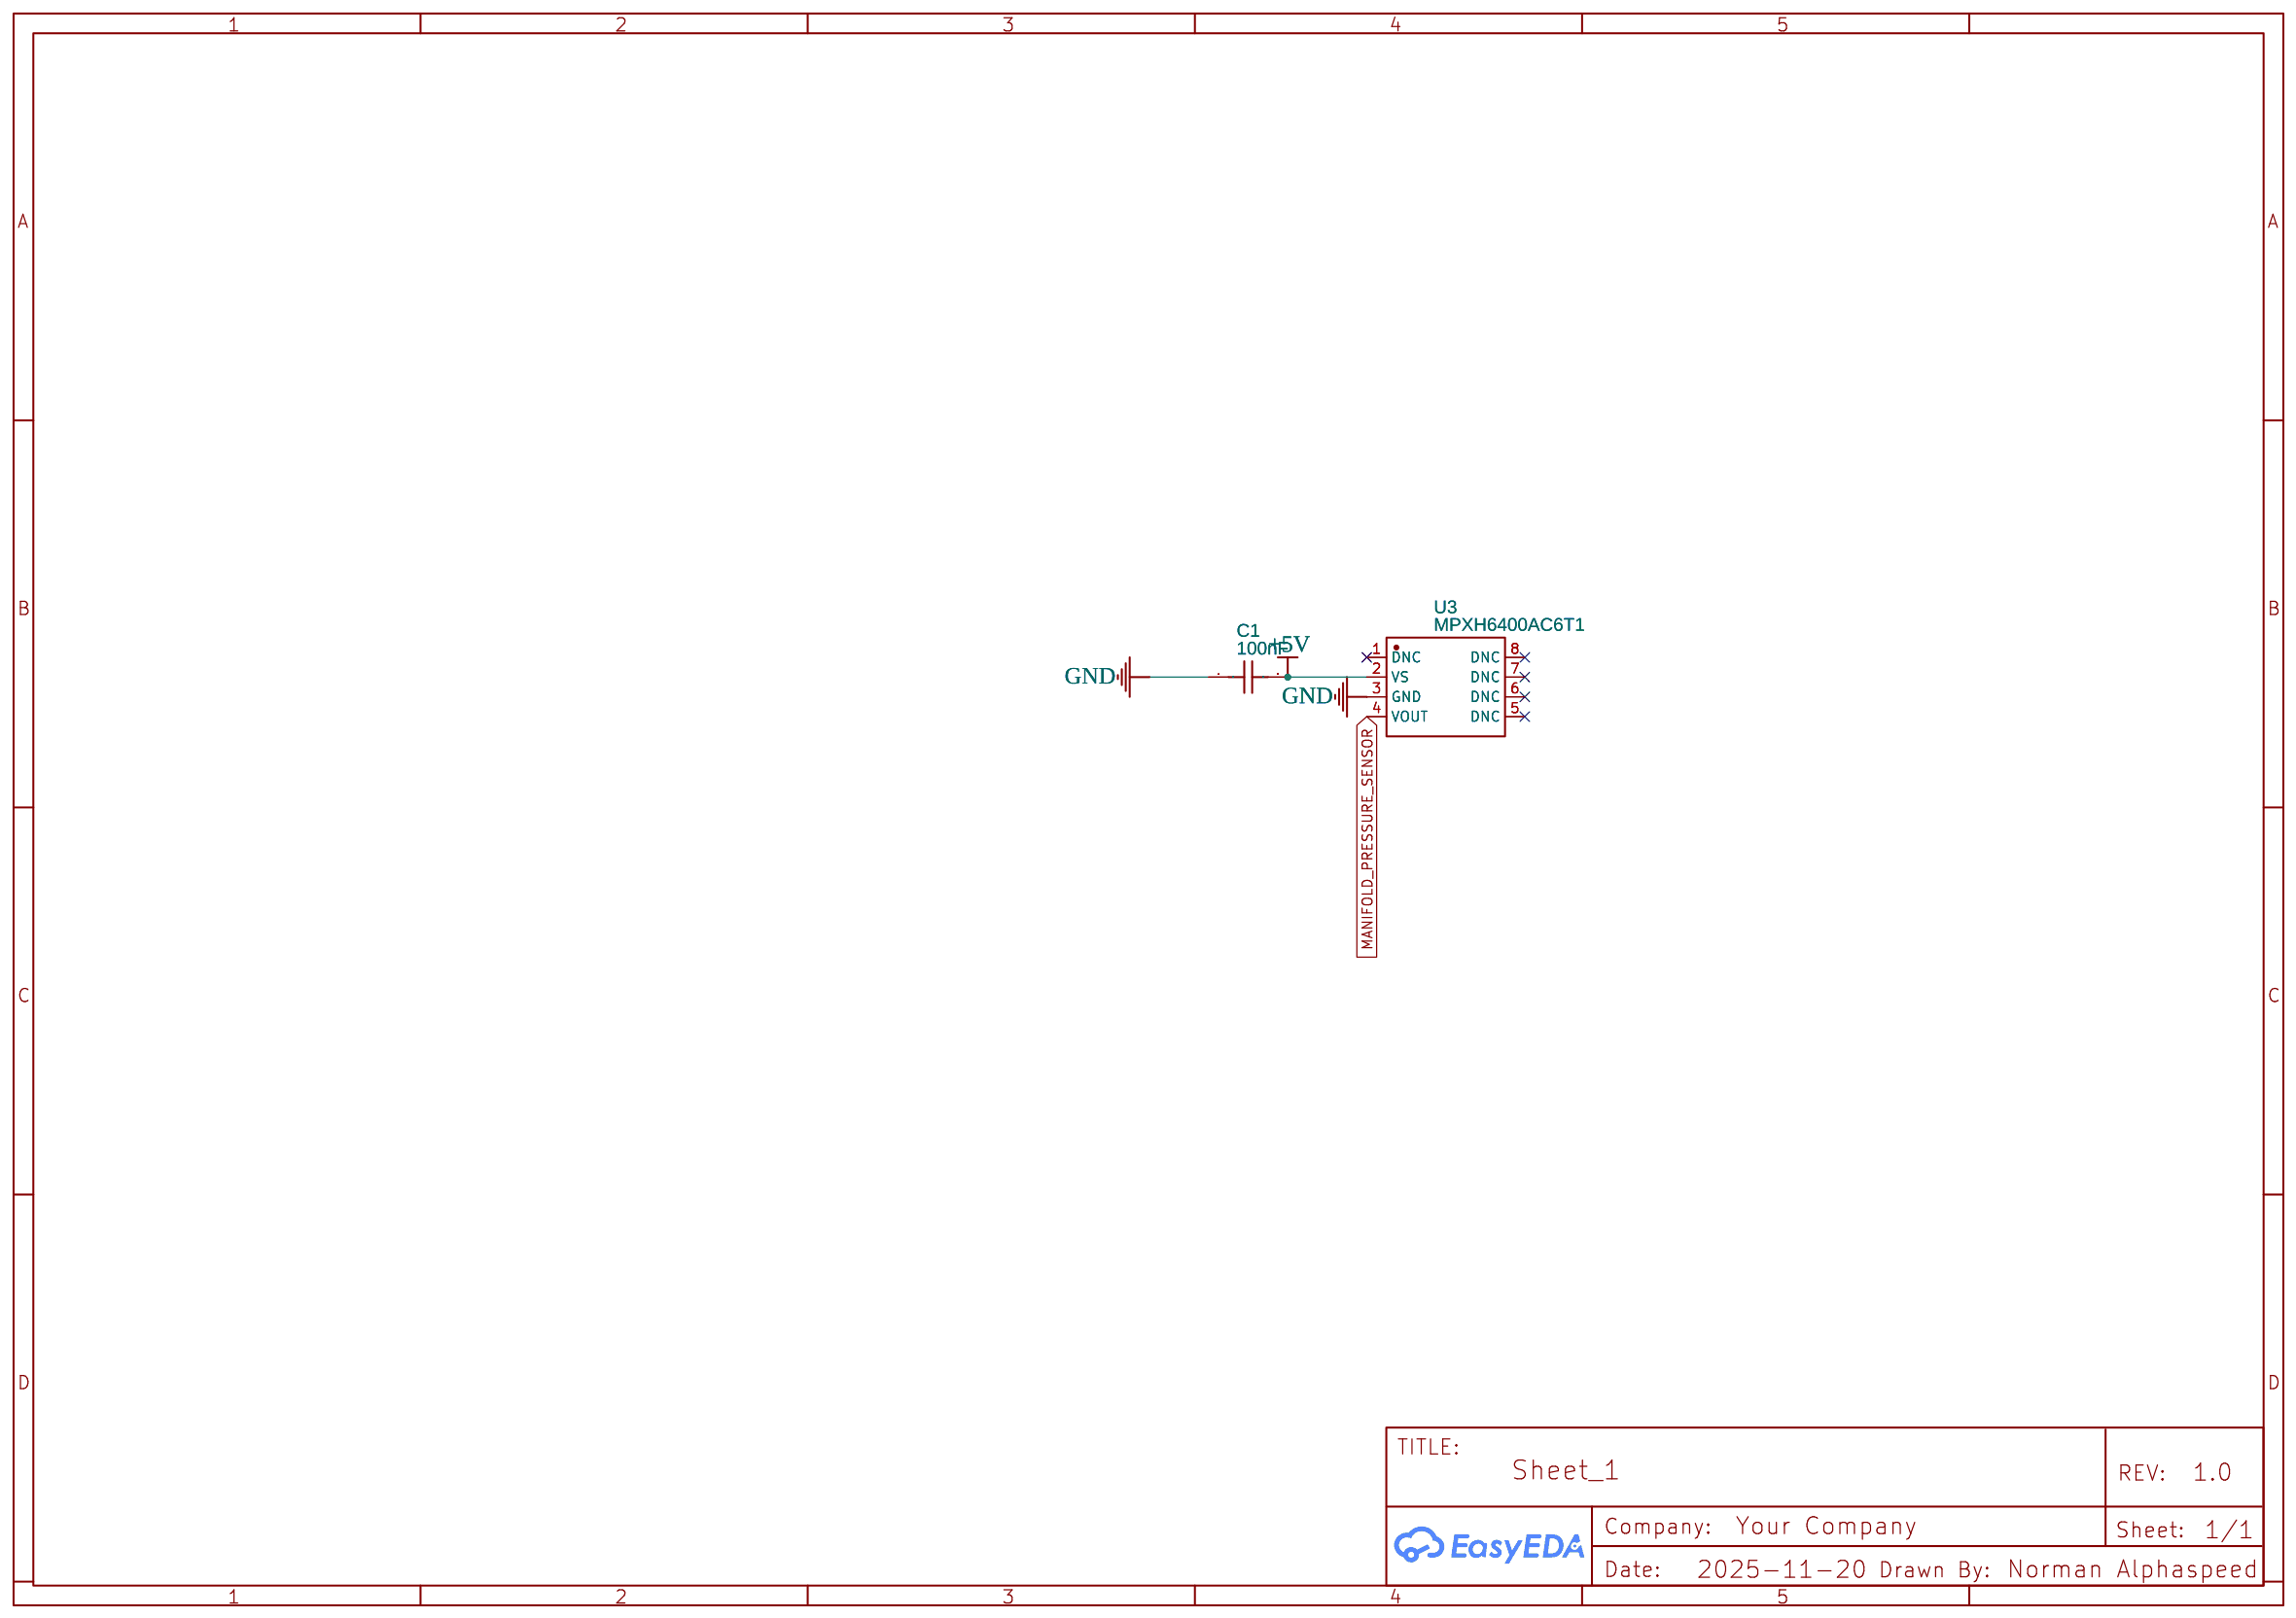
[diagram p9: MAP]
11 Knock: Date: 2025-11-20
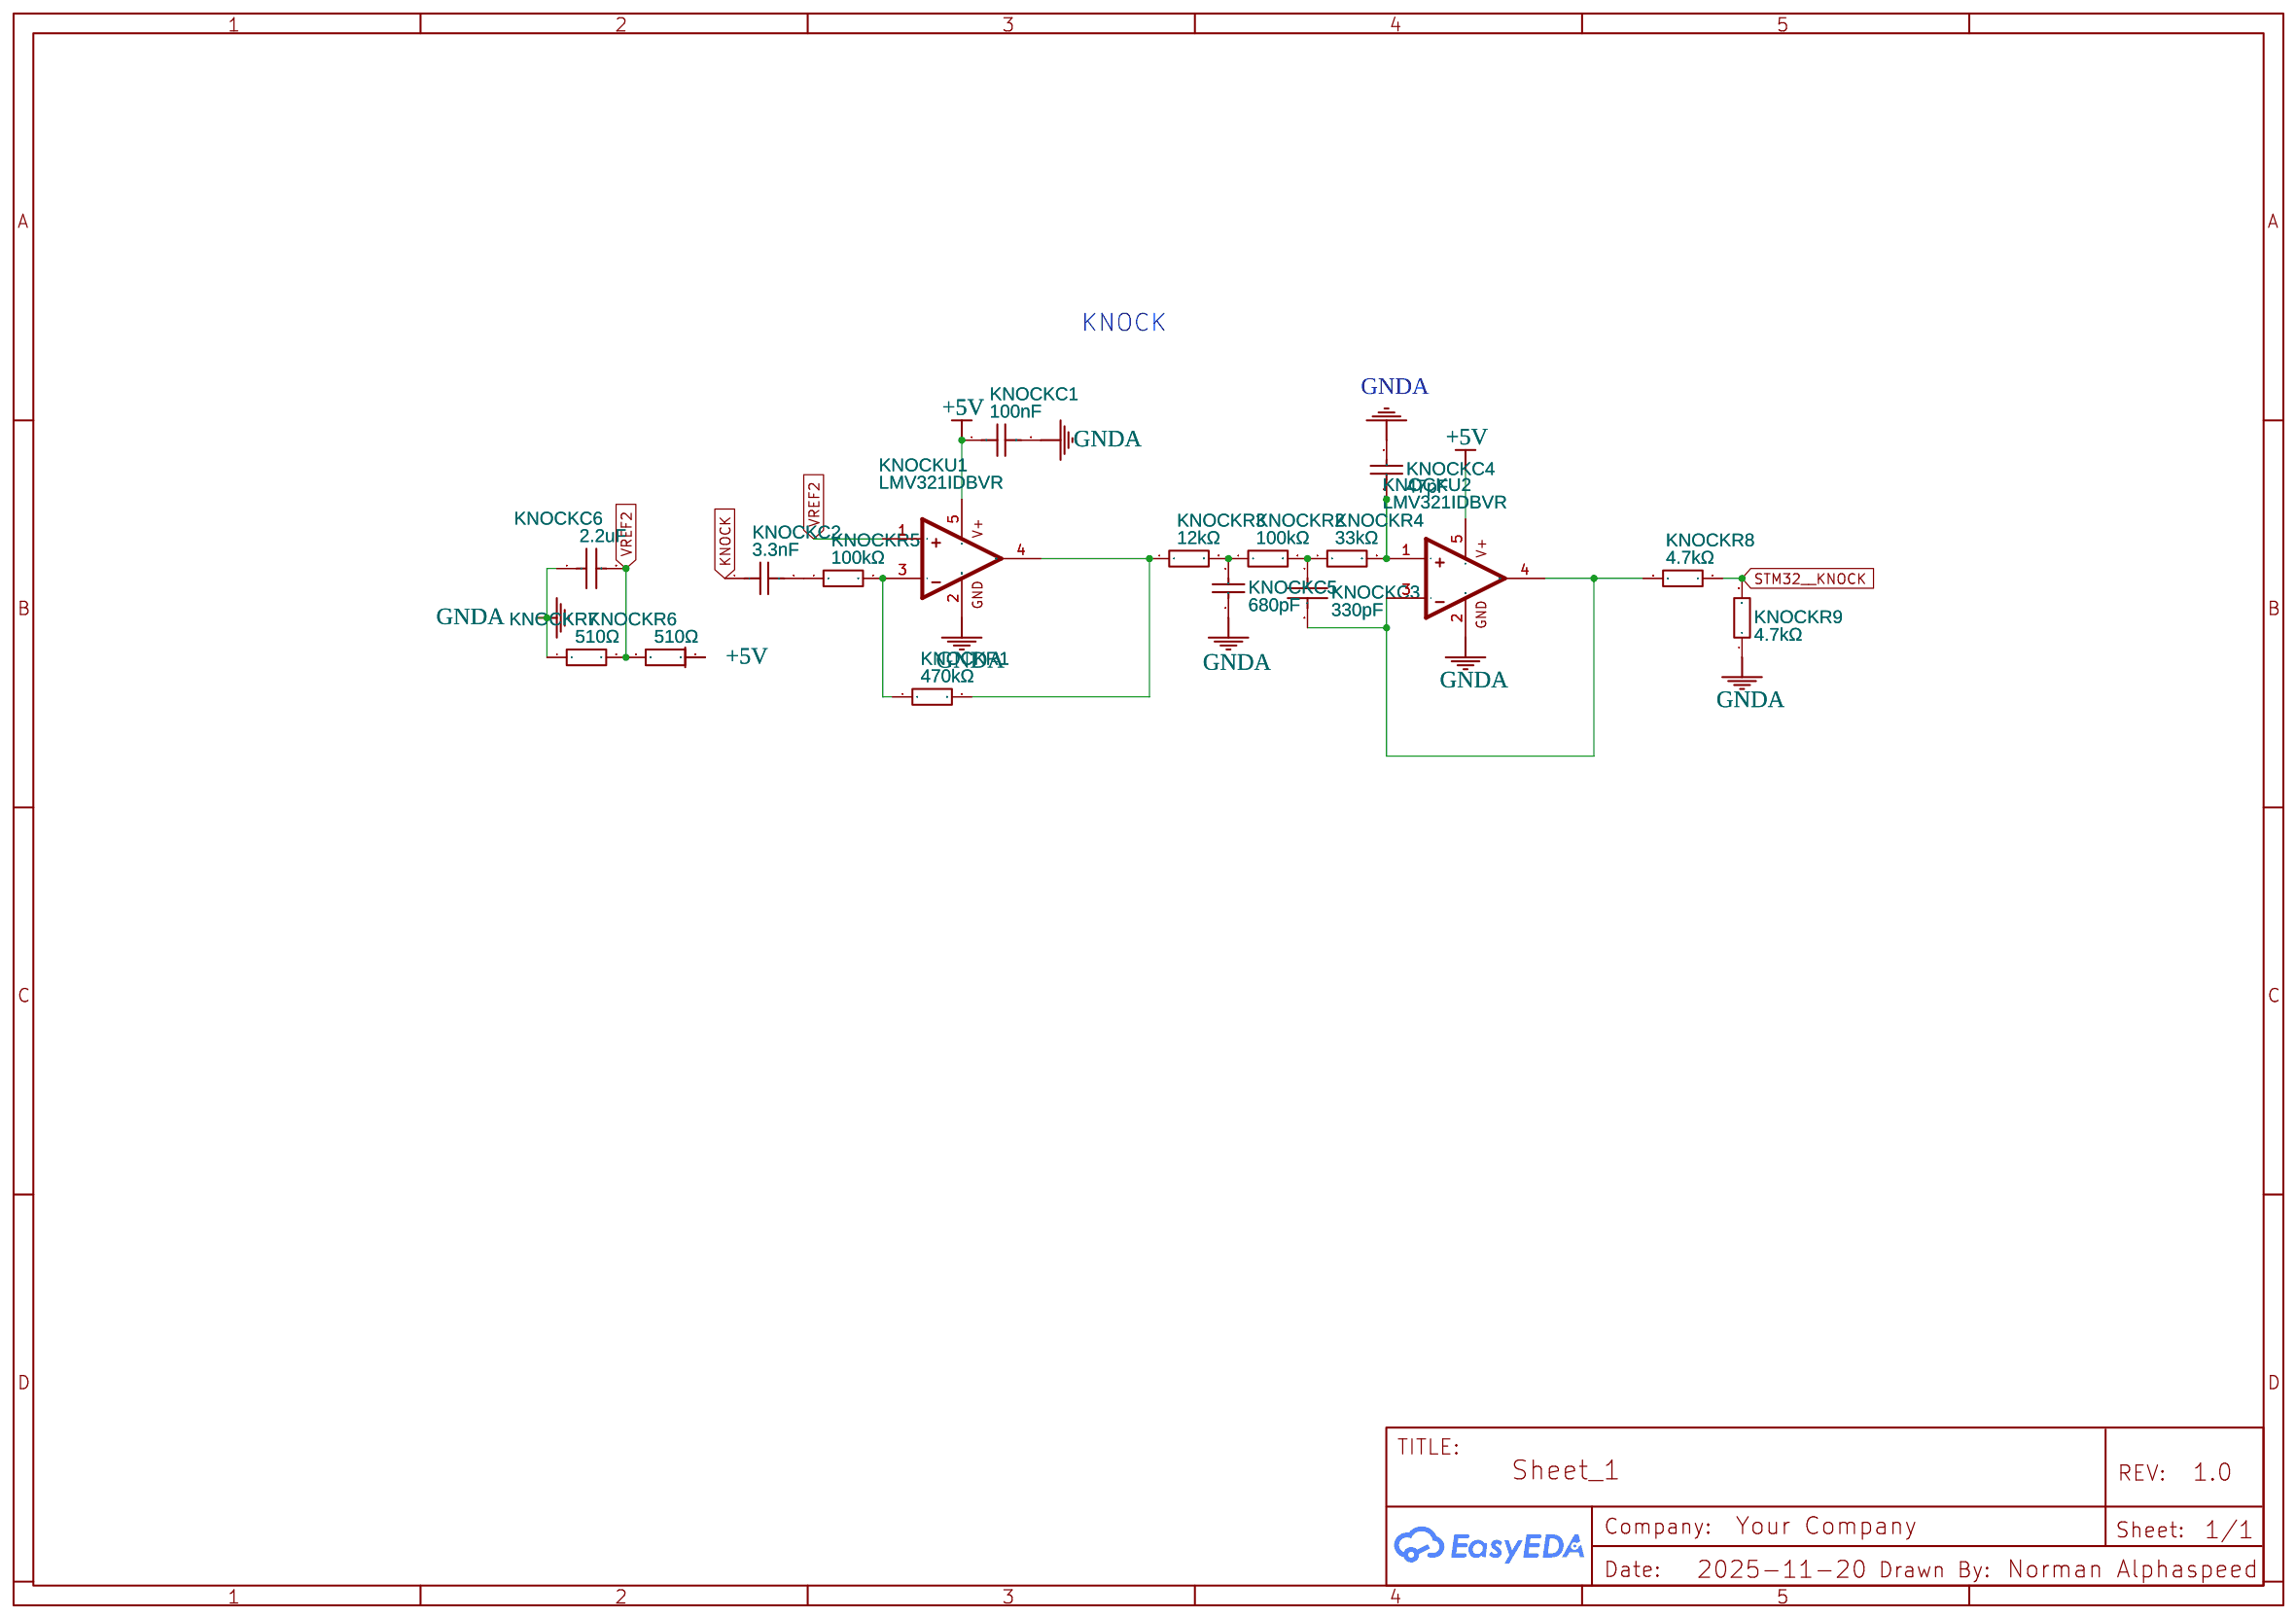
[diagram p10: Knock]
12 ETB: Date: 2025-11-20
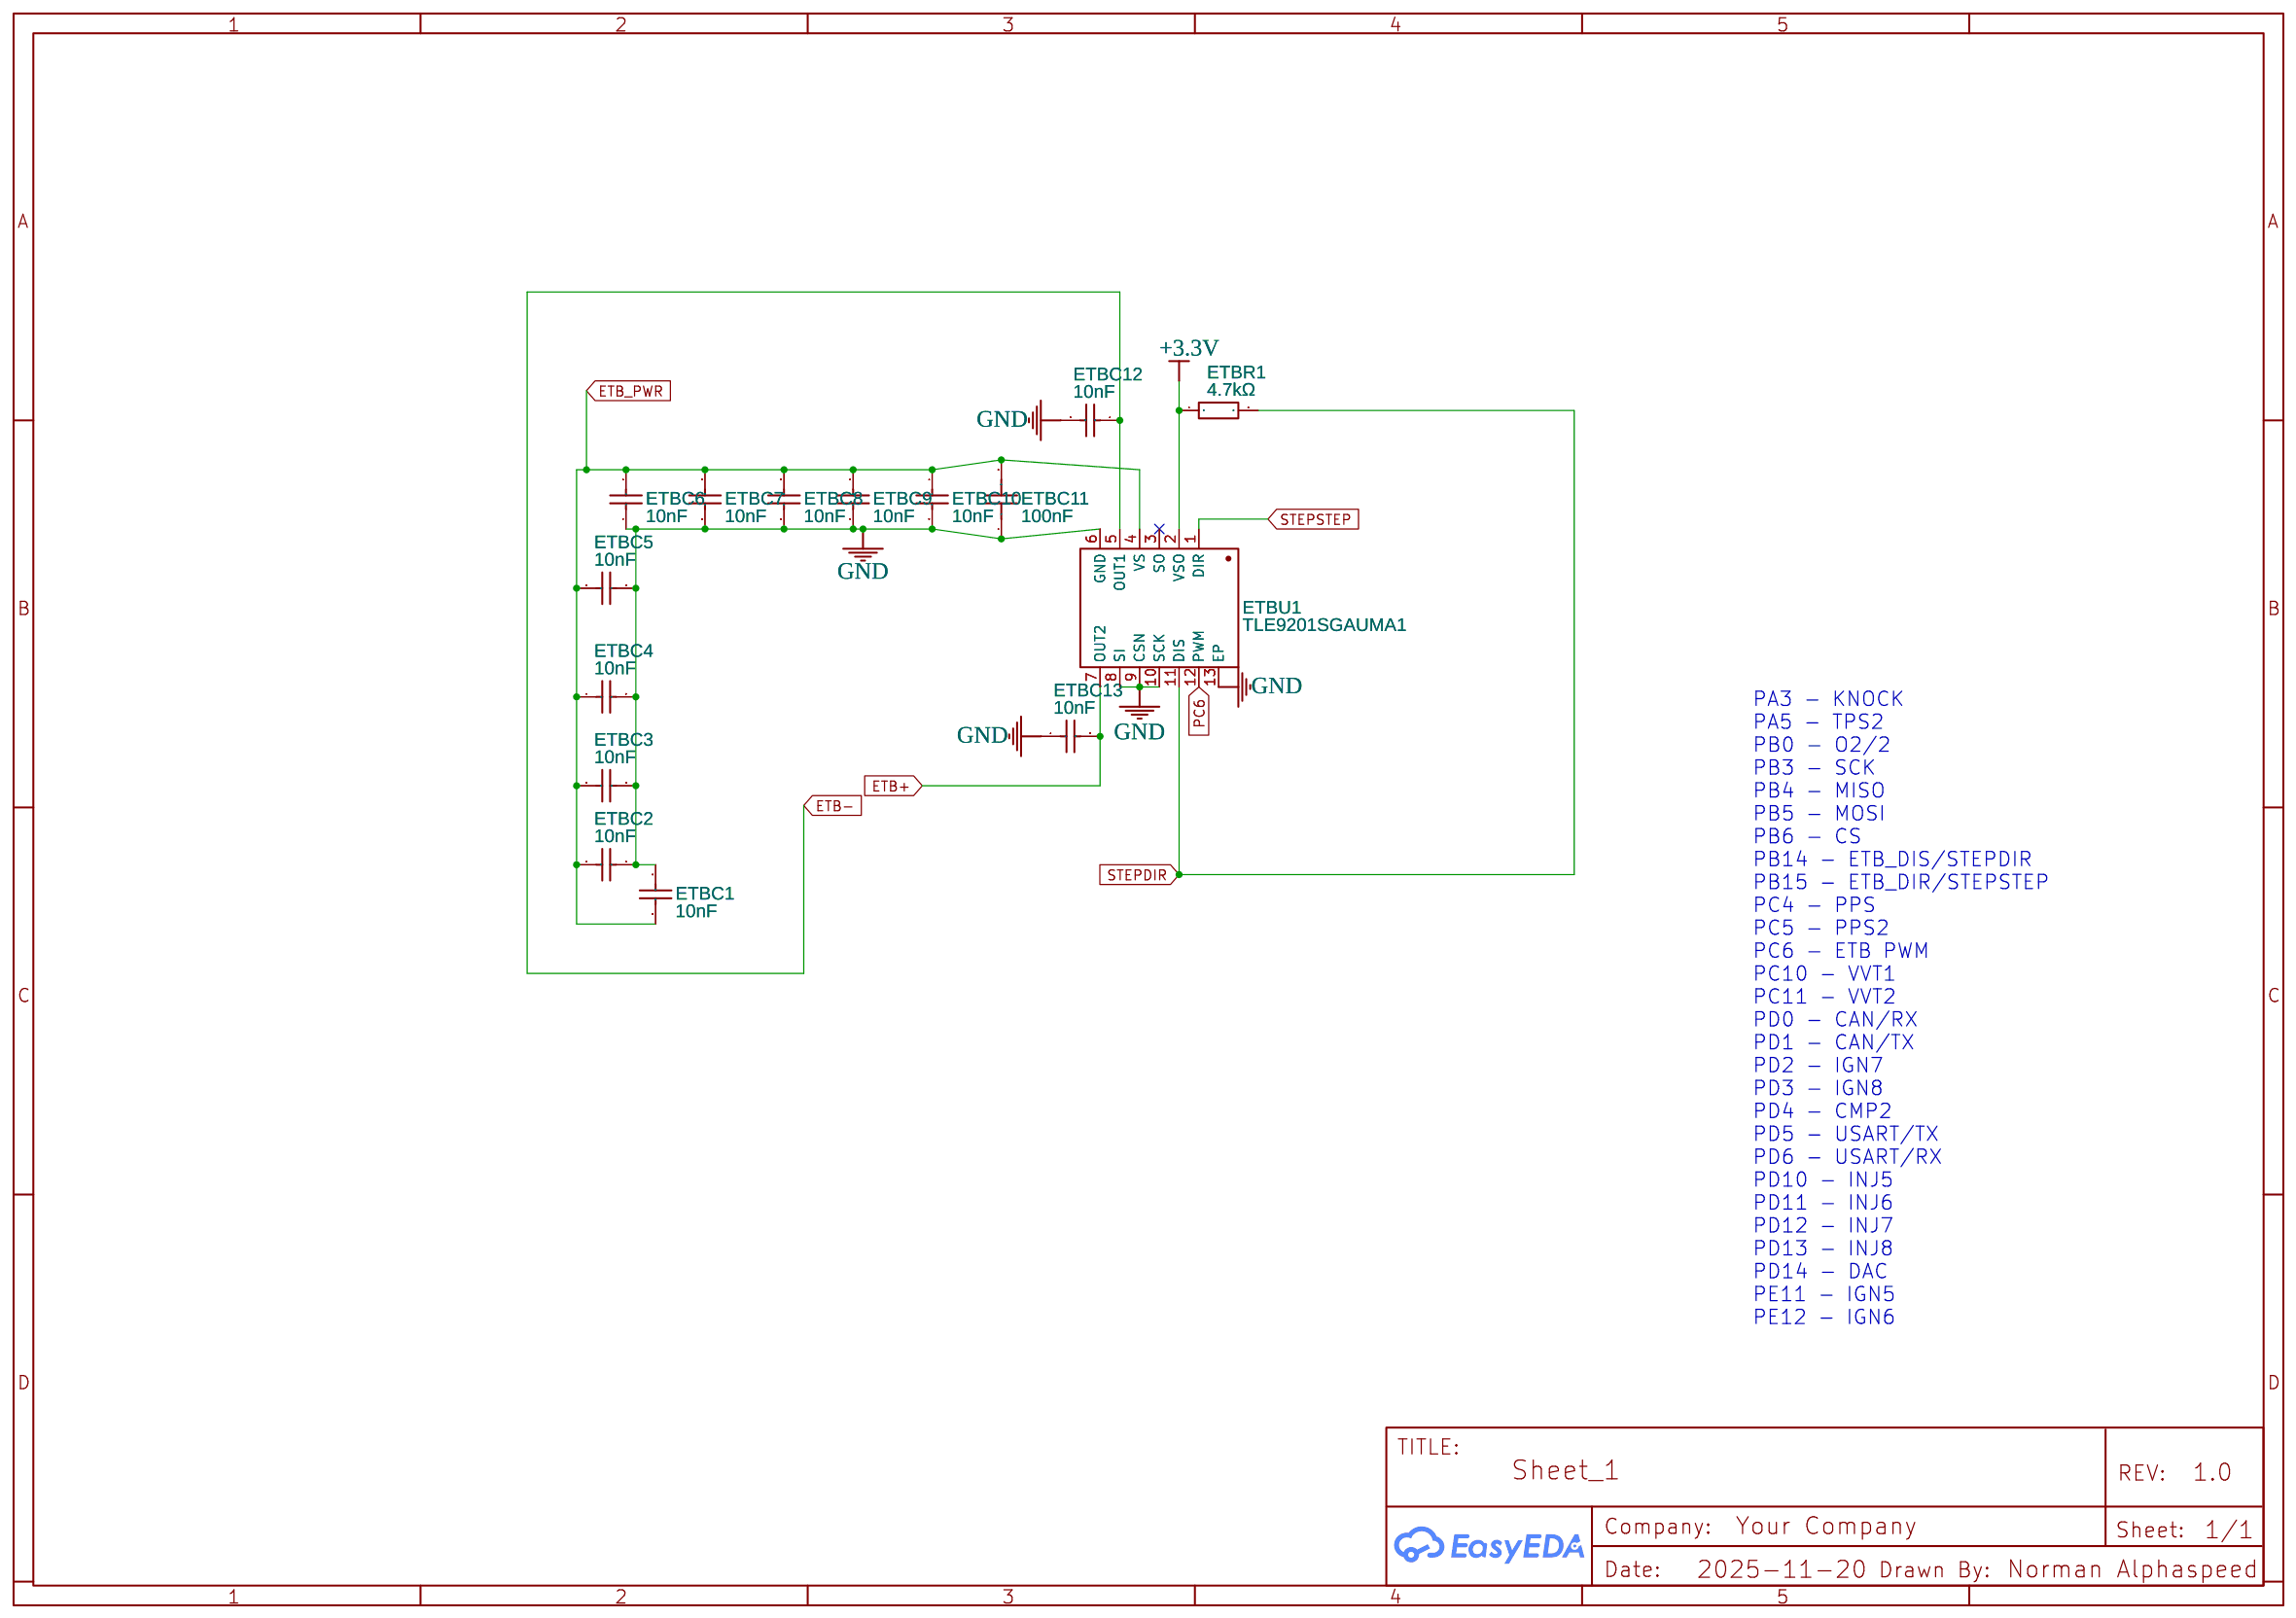
[diagram p11: ETB]
13 SD CARD: Date: 2025-11-21
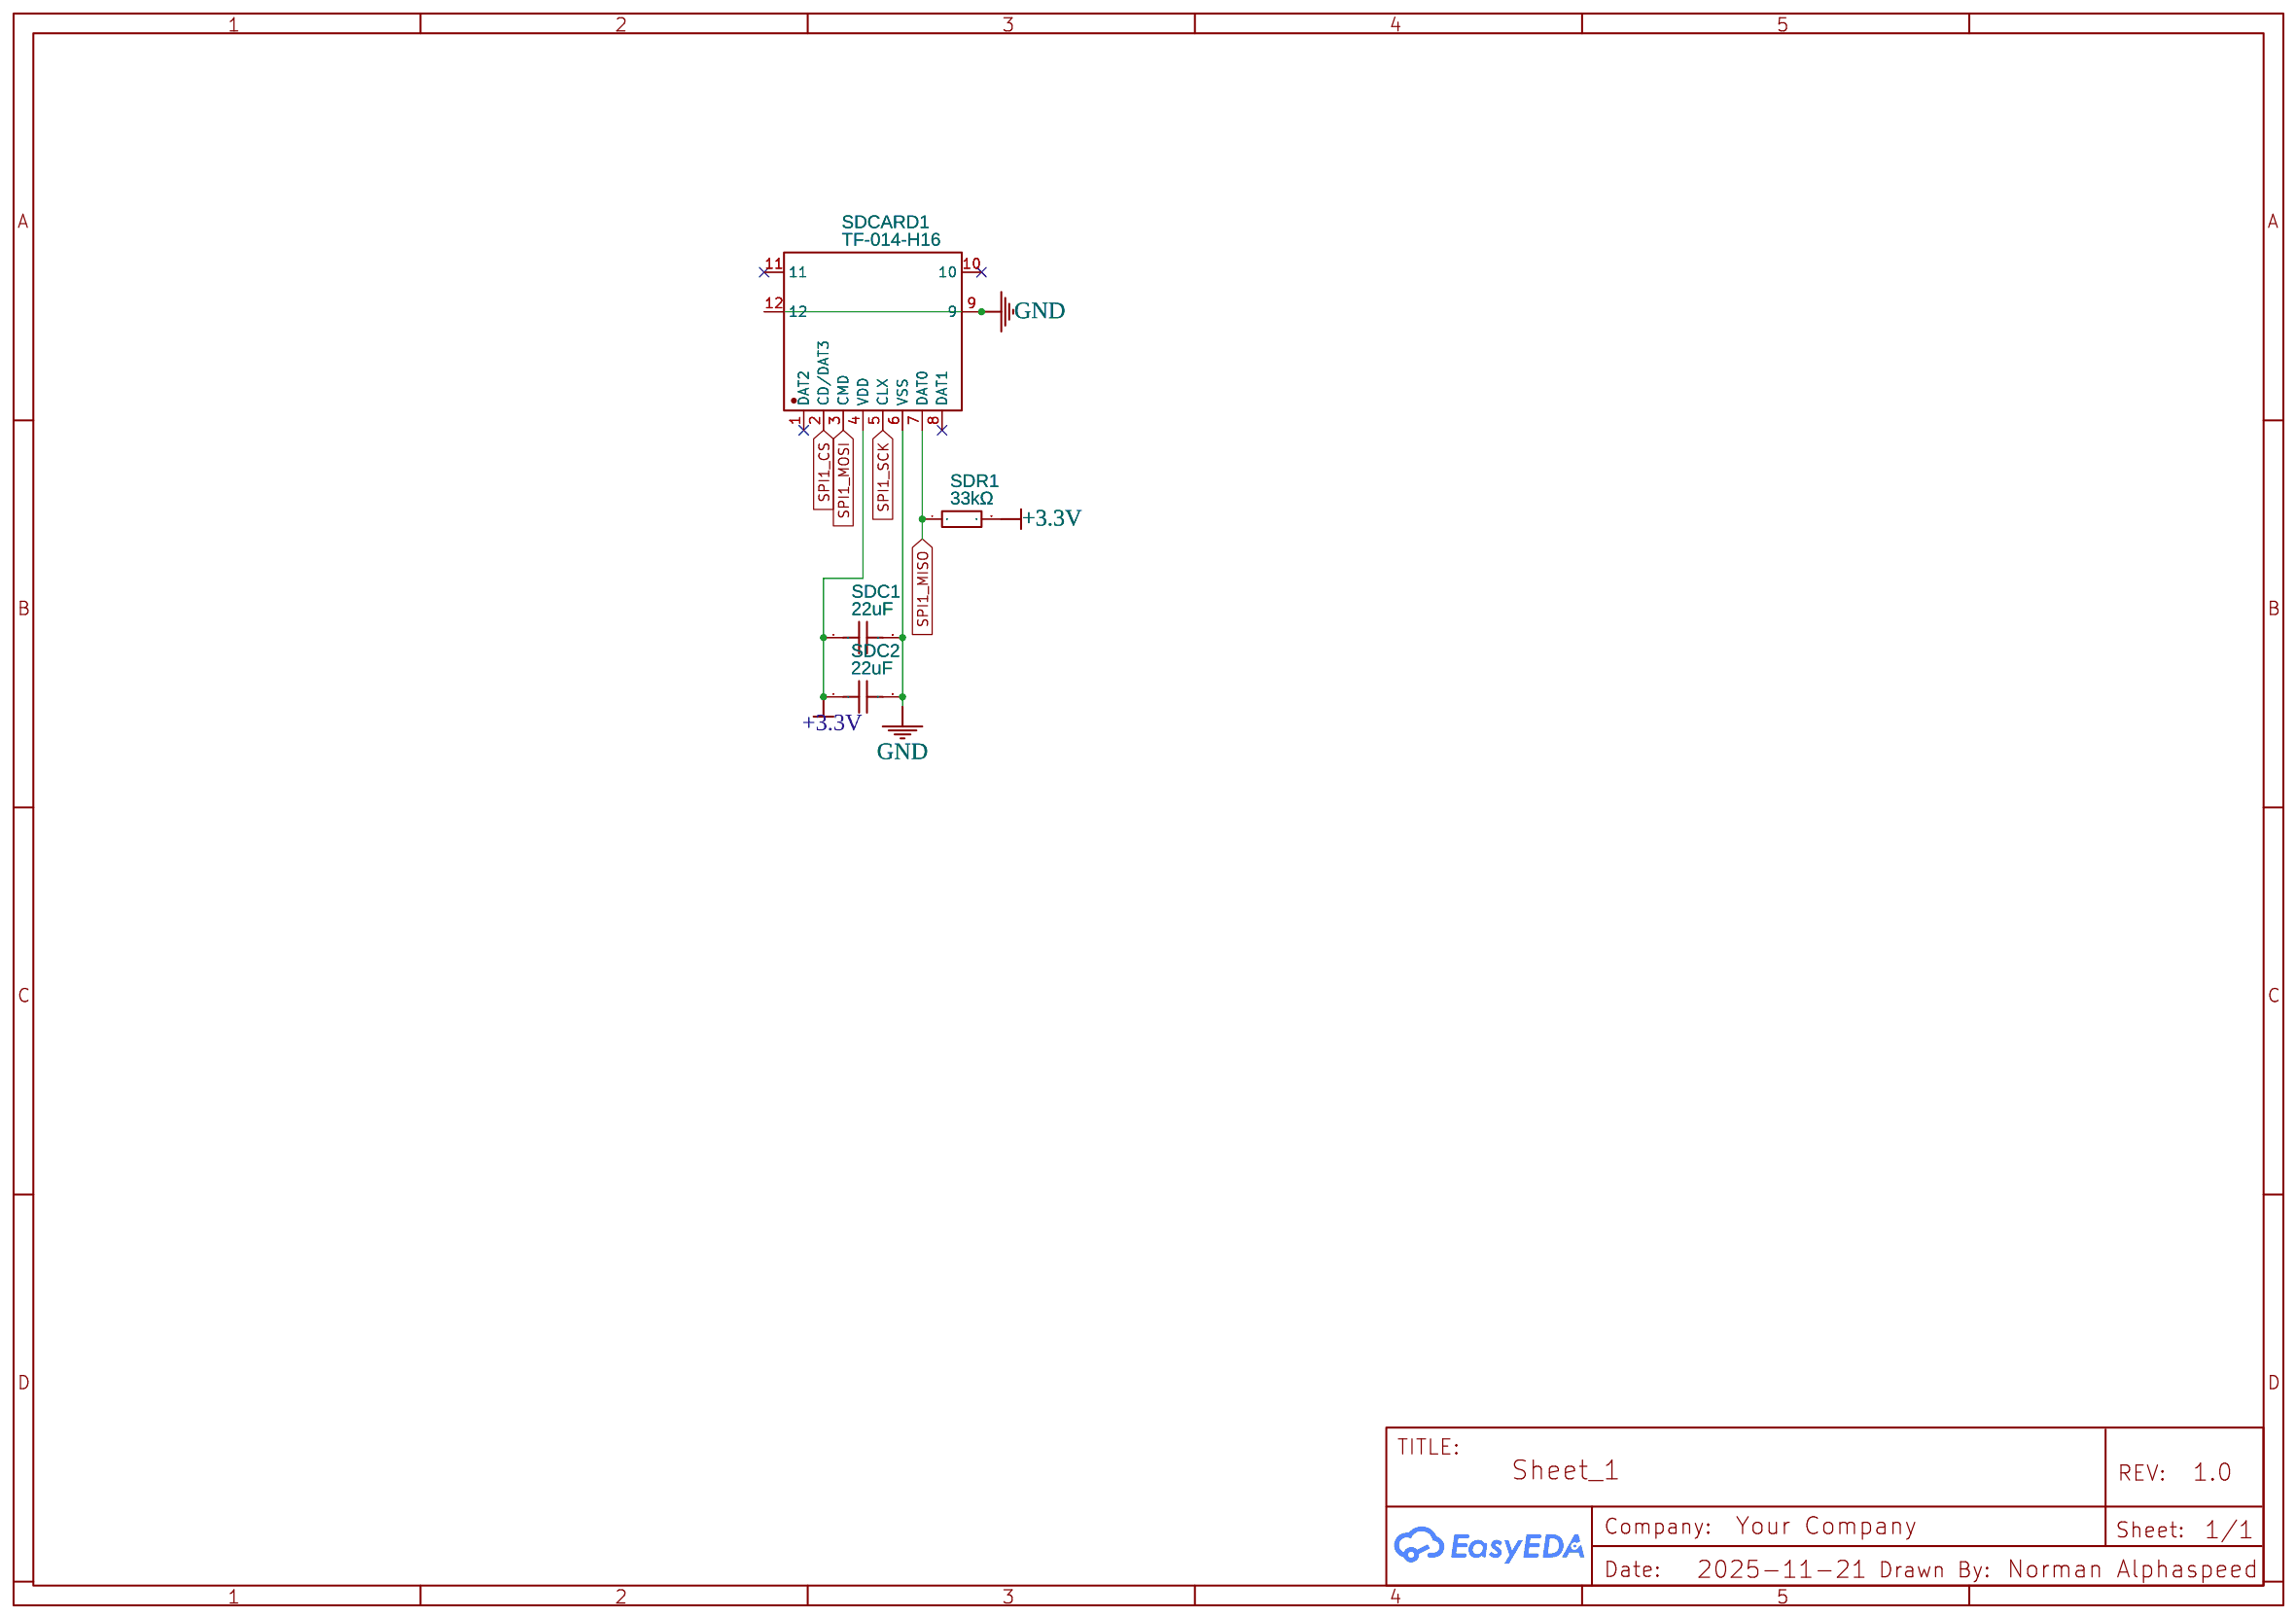
[diagram p12: SD CARD]

## Parts
sheet Analog
AVIAC1  100nF  [C0402]
AVIAC2  100nF  [C0402]
AVIAC4  100nF  [C0402]
AVIAC6  100nF  [C0402]
AVIAC26  100nF  [C0402]
AVIAD1  BAV70  [SOT-23_L2.9-W1.3-P1.90-LS2.4-BR]
AVIAD2  BAV70  [SOT-23_L2.9-W1.3-P1.90-LS2.4-BR]
AVIAR1  680kΩ  [R0402]
AVIAR2  4.7kΩ  [R0402]
AVIAR3  4.7kΩ  [R0402]
AVIAR4  4.7kΩ  [R0402]
AVIAR5  4.7kΩ  [R0402]
AVIAR6  4.7kΩ  [R0402]
AVIAR7  680kΩ  [R0402]
AVIAR8  4.7kΩ  [R0402]
AVIAR9  680kΩ  [R0402]
AVIAR10  4.7kΩ  [R0402]
AVIAR11  4.7kΩ  [R0402]
AVIAR12  4.7kΩ  [R0402]
AVIAR13  680kΩ  [R0402]
AVIAR14  4.7kΩ  [R0402]
AVIAR15  4.7kΩ  [R0402]
AVIAR16  4.7kΩ  [R0402]
AVIAU1  MCP6004T-I/ST(XBLW)  [TSSOP-14_L5.0-W4.5-P0.65-LS6.4-BL]  (sections 1,2,3,4)
sheet CKP
CKPC1  1nF  [C0603]
CKPC2  22uF  [C0603]
CKPC3  100nF  [C0603]
CKPLED1  19-217/GHC-YR1S2/3T  [LED0603-RD]
CKPR1  4.7kΩ  [R0402]
CKPR2  4.7kΩ  [R0402]
CKPR3  4.7kΩ  [R0402]
CKPR4  4.7kΩ  [R0402]
CKPR5  4.7kΩ  [R0402]
CKPR6  10kΩ  [R0402]
CKPR7  10kΩ  [R0402]
CKPU1  MAX9924UAUB+  [MSOP-10_L3.0-W3.0-P0.50-LS5.0-BL]
sheet Coils
IGNAD1  ZMM5V6  [LL-34_L3.5-W1.5-RD]
IGNALED2  KT-0603R  [LED0603-R-RD]
IGNAQ2  ISL9V3040D3ST  [TO-252-2_L6.5-W6.1-P4.58-LS10.0-BR]
IGNAR7  330Ω  [R0603]
IGNAR8  1kΩ  [R0603]
IGNBD1  ZMM5V6  [LL-34_L3.5-W1.5-RD]
IGNBLED2  KT-0603R  [LED0603-R-RD]
IGNBQ2  ISL9V3040D3ST  [TO-252-2_L6.5-W6.1-P4.58-LS10.0-BR]
IGNBR7  330Ω  [R0603]
IGNBR8  1kΩ  [R0603]
sheet Connector
BRAINH1  HDR-F-2.54_2x15  [HDR-F-2.54_2X15]
BRAINH2  HDR-F-2.54_2x10  [HDR-F-2.54_2X10]
BRAINH3  HDR-F-2.54_2x5  [HDR-F-2.54_2X5]
CN1  5557R-2*6P  [CONN-TH_12P-P4.20_5557R-2X6P]
CN2  5557R-2*3P  [CONN-TH_5557R-2X3P]
J5  HDR-M-2.54_1x2  [HDR-M-2.54_1X2]
U1  DBT50G-9.5-2P  [CONN-TH_2P-P9.50_DBT50G-9.5-2P]
U2  6437288-1  [CONN-TH_34P-6437288-1]
U4  XD-5557-5A  [CONN-TH_5P-P4.20_XD-5557-5A]
sheet Digital
HALLC1  1nF  [C0402]
HALLC2  1nF  [C0402]
HALLR1  4.7kΩ  [R0402]
HALLR2  4.7kΩ  [R0402]
HALLR3  4.7kΩ  [R0402]
HALLR4  4.7kΩ  [R0402]
HALLR5  10kΩ  [R0402]
HALLR6  10kΩ  [R0402]
HALLR7  10kΩ  [R0402]
HALLR8  10kΩ  [R0402]
HALLU1  SN74LVC2G17DBVR_C19829674  [SOT-23-6_L2.9-W1.6-P0.95-LS2.8-BL]
J2  HDR-M-2.54_1x2  [HDR-M-2.54_1X2]
STARTC1  100nF  [C0402]
STARTC2  100nF  [C0402]
STARTD2  ZMM5V1  [LL-34_L3.5-W1.5-RD]
STARTLED1  SZYY0402G  [LED0402-R-RD_GREEN]
STARTR1  1.5kΩ  [R0402]
STARTR2  1kΩ  [R0603]
STARTR3  1kΩ  [R0603]
STARTR4  100Ω  [R0402]
STARTR5  1.5kΩ  [R0402]
sheet Driver
DRVAR1  10Ω  [R0402]
DRVAR2  10Ω  [R0402]
DRVAR3  10Ω  [R0402]
DRVAR4  10Ω  [R0402]
DRVAR5  10Ω  [R0402]
DRVAR6  10Ω  [R0402]
DRVAR7  10Ω  [R0402]
DRVAR8  10Ω  [R0402]
DRVAU1  SN74LVC4245APWR  [TSSOP-24_L7.8-W4.4-P0.65-LS6.4-BL]
DRVBR1  10Ω  [R0402]
DRVBR2  10Ω  [R0402]
DRVBR3  10Ω  [R0402]
DRVBR4  10Ω  [R0402]
DRVBR6  10Ω  [R0402]
DRVBR7  10Ω  [R0402]
DRVBR8  10Ω  [R0402]
DRVBU1  SN74LVC4245APWR  [TSSOP-24_L7.8-W4.4-P0.65-LS6.4-BL]
J1  HDR-M-2.54_1x2  [HDR-M-2.54_1X2]
sheet ETB
ETBC1  10nF  [C0603]
ETBC2  10nF  [C0603]
ETBC3  10nF  [C0603]
ETBC4  10nF  [C0603]
ETBC5  10nF  [C0603]
ETBC6  10nF  [C0603]
ETBC7  10nF  [C0603]
ETBC8  10nF  [C0603]
ETBC9  10nF  [C0603]
ETBC10  10nF  [C0603]
ETBC11  100nF  [C0603]
ETBC12  10nF  [C0603]
ETBC13  10nF  [C0603]
ETBR1  4.7kΩ  [R0603]
ETBU1  TLE9201SGAUMA1  [PG-DSO-12_L7.8-W7.5-P1.00-LS10.3-BL]
sheet Injectors
INJAC1  1nF  [C0402]
INJAD1  SMAJ33CA  [SMA_L4.4-W2.6-LS5.0-BI]
INJALED1  KT-0603R  [LED0603-RD]
INJAQ1  NCE6020AK  [TO-252-2_L6.6-W6.1-P4.57-LS10.1-TL-CW]
INJAR1  1.5kΩ  [R0402]
INJBC1  1nF  [C0402]
INJBD1  SMAJ33CA  [SMA_L4.4-W2.6-LS5.0-BI]
INJBLED1  KT-0603R  [LED0603-RD]
INJBQ1  NCE6020AK  [TO-252-2_L6.6-W6.1-P4.57-LS10.1-TL-CW]
INJBR1  1.5kΩ  [R0402]
INJCC1  1nF  [C0402]
INJCD1  SMAJ33CA  [SMA_L4.4-W2.6-LS5.0-BI]
INJCLED1  KT-0603R  [LED0603-RD]
INJCQ1  NCE6020AK  [TO-252-2_L6.6-W6.1-P4.57-LS10.1-TL-CW]
INJCR1  1.5kΩ  [R0402]
INJDC1  1nF  [C0402]
INJDD1  SMAJ33CA  [SMA_L4.4-W2.6-LS5.0-BI]
INJDLED1  KT-0603R  [LED0603-RD]
INJDQ1  NCE6020AK  [TO-252-2_L6.6-W6.1-P4.57-LS10.1-TL-CW]
INJDR1  1.5kΩ  [R0402]
sheet Knock
KNOCKC1  100nF  [C0402]
KNOCKC2  3.3nF  [C0402]
KNOCKC3  330pF  [C0402]
KNOCKC4  47pF  [C0402]
KNOCKC5  680pF  [C0603]
KNOCKC6  2.2uF  [C0402]
KNOCKR1  470kΩ  [R0402]
KNOCKR2  100kΩ  [R0402]
KNOCKR3  12kΩ  [R0402]
KNOCKR4  33kΩ  [R0402]
KNOCKR5  100kΩ  [R0402]
KNOCKR6  510Ω  [R0402]
KNOCKR7  510Ω  [R0402]
KNOCKR8  4.7kΩ  [R0402]
KNOCKR9  4.7kΩ  [R0402]
KNOCKU1  LMV321IDBVR  [SOT-23-5_L3.0-W1.7-P0.95-LS2.8-BR]
KNOCKU2  LMV321IDBVR  [SOT-23-5_L3.0-W1.7-P0.95-LS2.8-BR]
sheet MAP
C1  100nF  [C0402]
U3  MPXH6400AC6T1  [SSOP-8_L7.4-W7.4-P1.27-LS10.4-BL]
sheet Onboard Relays
F1  XF-507P  [CONN-TH_XF-507P]
F2  XF-507P  [CONN-TH_XF-507P]
F4  XF-507P  [CONN-TH_XF-507P]
F5  XF-507P  [CONN-TH_XF-507P]
F6  XF-507P  [CONN-TH_XF-507P]
K1  HFKW/012-1ZW(136)  [RELAY-TH_HFKW-012-1ZW]
K2  HFKW/012-1ZW(136)  [RELAY-TH_HFKW-012-1ZW]
K4  HFV16-P/12-HST  [RELAY-TH_HFV16-P-12-HST]
K5  HFKW/012-1ZW(136)  [RELAY-TH_HFKW-012-1ZW]
K6  HFKW/012-1ZW(136)  [RELAY-TH_HFKW-012-1ZW]
LED1  KT-0603R  [LED0603-R-RD]
LED2  KT-0603R  [LED0603-R-RD]
LED3  KT-0603R  [LED0603-R-RD]
LED5  KT-0603R  [LED0603-R-RD]
LED6  KT-0603R  [LED0603-R-RD]
R1  1kΩ  [R0603]
R2  1kΩ  [R0603]
R3  1kΩ  [R0603]
R5  1kΩ  [R0603]
R6  1kΩ  [R0603]
sheet Outputs
DPOAR8  1kΩ  [R0603]
DPOARN1  10kΩ  [RES-ARRAY-SMD_0603-8P-L3.2-W1.6-BL]
DPOARN2  10kΩ  [RES-ARRAY-SMD_0603-8P-L3.2-W1.6-BL]
DPOAU1  ULN2003ADR  [SOIC-16_L9.9-W3.9-P1.27-LS6.0-BL]
SPAREC1  1nF  [C0603]
SPAREQ1  AO3400A  [SOT-23-3_L2.9-W1.6-P1.90-LS2.8-BR]
SPARER1  4.7kΩ  [R0603]
STRTD13  MRA4007T3G  [SMA_L4.3-W2.6-LS5.2-RD]
STRTLED1  KT-0603R  [LED0603-RD]
STRTQ1  AO3400A  [SOT-23-3_L2.9-W1.6-P1.90-LS2.8-BR]
STRTQ8  AOD4185_C879147  [TO-252-2_L6.6-W6.1-P4.58-LS9.9-BR]
STRTR1  1kΩ  [R0402]
STRTR2  4.7kΩ  [R0402]
STRTR3  4.7kΩ  [R0402]
sheet SD CARD
SDC1  22uF  [C0603]
SDC2  22uF  [C0603]
SDCARD1  TF-014-H16  [TF-SMD_TF-014-H16]
SDR1  33kΩ  [R0603]

## Library data of the parts
AVIAC1 AVIAC2 AVIAC4 AVIAC6 AVIAC26 STARTC1 STARTC2 = CL05B104KB54PNC: Supplier: LCSC; Supplier Part: C307331; Manufacturer: Samsung Electro-Mechanics; Contributor: LCSC; JLCPCB Part Class: Basic Part
AVIAD1 AVIAD2 = BAV70_C402233: Supplier: LCSC; Supplier Part: C402233; Manufacturer: LGE(鲁光); Contributor: LCSC; JLCPCB Part Class: Extended Part
AVIAR1 AVIAR7 AVIAR9 AVIAR13 = RC0402FR-07680KL: Contributor: LCSC; Supplier: LCSC; Manufacturer: YAGEO(国巨); Supplier Part: C163456; JLCPCB Part Class: Extended Part
AVIAR2-AVIAR6 AVIAR8 AVIAR10-AVIAR12 AVIAR14-AVIAR16 CKPR1-CKPR5 HALLR1-HALLR4 KNOCKR8 KNOCKR9 STRTR2 STRTR3 = 0402WGF4701TCE: Supplier: LCSC; Manufacturer: UNI-ROYAL(厚声); Supplier Part: C25900; JLCPCB Part Class: Basic Part
AVIAU1 = MCP6004T-I/ST(XBLW): Supplier: LCSC; Supplier Part: C32713110; Manufacturer: XBLW(芯伯乐); subpart_no: 1; JLCPCB Part Class: Extended Part
CKPC1 SPAREC1 = CL10B102KB8NNNC: Supplier: LCSC; Manufacturer: SAMSUNG(三星); Supplier Part: C1588; JLCPCB Part Class: Basic Part
CKPC2 SDC1 SDC2 = CL10A226MQ8NRNC: Supplier: LCSC; Manufacturer: SAMSUNG(三星); Supplier Part: C59461; JLCPCB Part Class: Basic Part
CKPC3 ETBC11 = CC0603KRX7R9BB104: Supplier: LCSC; Manufacturer: YAGEO(国巨); Supplier Part: C14663; JLCPCB Part Class: Basic Part
CKPLED1 = 19-217/GHC-YR1S2/3T: Supplier: LCSC; Manufacturer: EVERLIGHT(亿光); Supplier Part: C72043; JLCPCB Part Class: Basic Part
CKPR6 CKPR7 = 0402WGF1002TCE: Supplier: LCSC; Manufacturer: UNI-ROYAL(厚声); Supplier Part: C25744; JLCPCB Part Class: Basic Part
CKPU1 = MAX9924UAUB+: Contributor: LCSC; Supplier: LCSC; Manufacturer: MAXIM(美信); Supplier Part: C143633; JLCPCB Part Class: Extended Part
IGNAD1 IGNBD1 = ZMM5V6: Supplier: LCSC; Manufacturer: SEMTECH; Supplier Part: C8062; JLCPCB Part Class: Basic Part
IGNALED2 IGNBLED2 INJALED1 INJBLED1 INJCLED1 INJDLED1 STRTLED1 = KT-0603R: Supplier: LCSC; Manufacturer: KENTO; Supplier Part: C2286; JLCPCB Part Class: Basic Part
IGNAQ2 IGNBQ2 = ISL9V3040D3ST: Contributor: LCSC; Supplier: LCSC; Supplier Part: C462128; Manufacturer: onsemi(安森美); JLCPCB Part Class: Extended Part
IGNAR7 IGNBR7 = 0603WAF3300T5E: Supplier: LCSC; Manufacturer: UniOhm; Supplier Part: C23138; Resistance (Ohms): 330; JLCPCB Part Class: Basic Part
DPOAR8 IGNAR8 IGNBR8 STARTR2 STARTR3 = 0603WAF1001T5E: Supplier: LCSC; Manufacturer: UniOhm; Supplier Part: C21190; Resistance (Ohms): 1K; JLCPCB Part Class: Basic Part
BRAINH1 = HDR-F-2.54_2x15: Supplier Part: C169818; Supplier: LCSC; Contributor: LCEDA_Lib
BRAINH2 = HDR-F-2.54_2x10: Supplier Part: C30867; Supplier: LCSC; Contributor: LCEDA_Lib
BRAINH3 = HDR-F-2.54_2x5: Supplier Part: C30419; Supplier: LCSC; Contributor: LCEDA_Lib
CN1 = 5557R-2*6P: Supplier: LCSC; Supplier Part: C477839; Manufacturer: Ckmtw(灿科盟); Contributor: LCSC; JLCPCB Part Class: Extended Part
CN2 = 5557R-2*3P: Supplier: LCSC; Manufacturer: Ckmtw(灿科盟); Manufacturer Part: W-5557R06P-0000; Supplier Part: C124425; JLCPCB Part Class: Extended Part
J1 J2 J5 = HDR-M-2.54_1x2: Supplier Part: C124375; Supplier: LCSC; Contributor: LCEDA_Lib
U1 = DBT50G-9.5-2P: Supplier: LCSC; Supplier Part: C395958; Manufacturer: DIBO(地博电气); Contributor: LCSC; JLCPCB Part Class: Extended Part
U2 = 6437288-1: Contributor: LCSC; Supplier: LCSC; Supplier Part: C574787; Manufacturer: TE Connectivity(美国泰科); JLCPCB Part Class: Extended Part
U4 = XD-5557-5A: Supplier: LCSC; Supplier Part: C19193350; Manufacturer: XUNDA(讯答); Contributor: lcsc
HALLC1 HALLC2 = 0402B102K500NT: Supplier: LCSC; Manufacturer: FH; Supplier Part: C1523; JLCPCB Part Class: Basic Part
HALLR5-HALLR8 = 0402WGF1002TCE: Supplier: LCSC; Manufacturer: UNI-ROYAL(厚声); Supplier Part: C25744; JLCPCB Part Class: Basic Part; link: https://lcsc.com/eda_search?q=C25744&%26type=1&ref=editor
HALLU1 = SN74LVC2G17DBVR_C19829674: Supplier: LCSC; Supplier Part: C19829674; Manufacturer: TECH PUBLIC(台舟); Manufacturer Part: SN74LVC2G17DBVR; JLCPCB Part Class: Extended Part; Contributor: lcsc
STARTD2 = ZMM5V1: Supplier: LCSC; Manufacturer: SEMTECH; Supplier Part: C8061; JLCPCB Part Class: Extended Part
STARTLED1 = SZYY0402G: Supplier: LCSC; Supplier Part: C434446; Manufacturer: yongyu(永裕光电); JLCPCB Part Class: Extended Part; Contributor: LCSC
INJAR1 INJBR1 INJCR1 INJDR1 STARTR1 STARTR5 = 0402WGF1501TCE: Supplier: LCSC; Manufacturer: UNI-ROYAL(厚声); Supplier Part: C25867; Resistance (Ohms): 1.5K; JLCPCB Part Class: Basic Part
STARTR4 = 0402WGF1000TCE: Supplier: LCSC; Manufacturer: UNI-ROYAL(厚声); Supplier Part: C25076; Resistance (Ohms): 100; JLCPCB Part Class: Basic Part
DRVAR1-DRVAR8 DRVBR1-DRVBR4 DRVBR6-DRVBR8 = 0402WGF100JTCE: Supplier: LCSC; Manufacturer: UNI-ROYAL(厚声); Supplier Part: C25077; JLCPCB Part Class: Basic Part
DRVAU1 DRVBU1 = SN74LVC4245APWR: Supplier: LCSC; Manufacturer: TI(德州仪器); Supplier Part: C7859; JLCPCB Part Class: Extended Part
ETBC1-ETBC10 ETBC12 ETBC13 = 0603B103K500NT: Supplier: LCSC; Manufacturer: FH(风华); Supplier Part: C57112; JLCPCB Part Class: Basic Part
ETBR1 = 0603WAF4701T5E: Supplier: LCSC; Manufacturer: UNI-ROYAL(厚声); Supplier Part: C23162; JLCPCB Part Class: Basic Part
ETBU1 = TLE9201SGAUMA1: Contributor: LCSC; Supplier: LCSC; Supplier Part: C2653438; Manufacturer: Infineon(英飞凌); JLCPCB Part Class: Extended Part
INJAC1 INJBC1 INJCC1 INJDC1 = 0402B102K500NT: Supplier: LCSC; Manufacturer: FH(风华); Supplier Part: C1523; JLCPCB Part Class: Basic Part
INJAD1 INJBD1 INJCD1 INJDD1 = SMAJ33CA_C115251: Supplier: LCSC; Manufacturer: MDD; Supplier Part: C115251; JLCPCB Part Class: Extended Part
INJAQ1 INJBQ1 INJCQ1 INJDQ1 = NCE6020AK: Supplier: LCSC; Manufacturer: NCE(无锡新洁能); Supplier Part: C108639; JLCPCB Part Class: Extended Part
KNOCKC1 = CL05B104KB54PNC: Contributor: LCSC; Supplier: LCSC; Supplier Part: C307331; Manufacturer: SAMSUNG(三星); JLCPCB Part Class: Basic Part; link: https://lcsc.com/eda_search?q=C307331&%26type=1&ref=editor
KNOCKC2 = CL05B332KB5NNNC: Supplier: LCSC; Manufacturer: SAMSUNG(三星); Supplier Part: C26404; JLCPCB Part Class: Basic Part; link: https://lcsc.com/eda_search?q=C26404&%26type=1&ref=editor
KNOCKC3 = CL05C331JB5NNNC: Supplier: LCSC; Manufacturer: SAMSUNG(三星); Supplier Part: C13533; JLCPCB Part Class: Basic Part; link: https://lcsc.com/eda_search?q=C13533&%26type=1&ref=editor
KNOCKC4 = 0402CG470J500NT: Supplier: LCSC; Manufacturer: FH(风华); Supplier Part: C1567; JLCPCB Part Class: Basic Part; link: https://lcsc.com/eda_search?q=C1567&%26type=1&ref=editor
KNOCKC5 = 0603B681K500NT: Supplier: LCSC; Manufacturer: FH(风华); Supplier Part: C1630; JLCPCB Part Class: Basic Part; link: https://lcsc.com/eda_search?q=C1630&%26type=1&ref=editor
KNOCKC6 = CL05A225MQ5NSNC: Supplier: LCSC; Manufacturer: SAMSUNG(三星); Supplier Part: C12530; JLCPCB Part Class: Basic Part
KNOCKR1 = 0402WGF4703TCE: Supplier: LCSC; Manufacturer: UNI-ROYAL(厚声); Supplier Part: C25790; JLCPCB Part Class: Basic Part; link: https://lcsc.com/eda_search?q=C25790&%26type=1&ref=editor
KNOCKR2 KNOCKR5 = 0402WGF1003TCE: Supplier: LCSC; Manufacturer: UNI-ROYAL(厚声); Supplier Part: C25741; JLCPCB Part Class: Basic Part; link: https://lcsc.com/eda_search?q=C25741&%26type=1&ref=editor
KNOCKR3 = 0402WGF1202TCE: Supplier: LCSC; Manufacturer: UNI-ROYAL(厚声); Supplier Part: C25752; JLCPCB Part Class: Basic Part; link: https://lcsc.com/eda_search?q=C25752&%26type=1&ref=editor
KNOCKR4 = 0402WGF3302TCE: Supplier: LCSC; Manufacturer: UNI-ROYAL(厚声); Supplier Part: C25779; JLCPCB Part Class: Basic Part; link: https://lcsc.com/eda_search?q=C25779&%26type=1&ref=editor
KNOCKR6 KNOCKR7 = 0402WGF5100TCE: Supplier: LCSC; Manufacturer: UNI-ROYAL(厚声); Supplier Part: C25123; JLCPCB Part Class: Basic Part
KNOCKU1 KNOCKU2 = LMV321IDBVR: Supplier: LCSC; Manufacturer: TI(德州仪器); Supplier Part: C7972; JLCPCB Part Class: Basic Part; link: https://lcsc.com/eda_search?q=C7972&%26type=1&ref=editor
C1 = CL05B104KB54PNC: Contributor: LCSC; Supplier: LCSC; Supplier Part: C307331; Manufacturer: SAMSUNG(三星); JLCPCB Part Class: Basic Part
U3 = MPXH6400AC6T1: Contributor: LCSC; Supplier: LCSC; Supplier Part: C2828031; Manufacturer: NXP(恩智浦); JLCPCB Part Class: Extended Part
F1 F2 F4-F6 = XF-507P: Supplier: LCSC; Supplier Part: C668119; Manufacturer: XFCN(兴飞); link: https://atta.szlcsc.com/upload/public/pdf/source/20210825/7557D7920E5607B38A356D661AFA8BB4.pdf; JLCPCB Part Class: Extended Part; Contributor: lcsc
K1 K2 K5 K6 = HFKW/012-1ZW(136): Contributor: LCSC; Supplier: LCSC; Supplier Part: C3644; Manufacturer: HF(宏发); JLCPCB Part Class: Extended Part
K4 = HFV16-P/12-HST: Supplier: LCSC; Supplier Part: C2757423; Manufacturer: HF(宏发); Contributor: LCSC; JLCPCB Part Class: Extended Part
LED1-LED3 LED5 LED6 = KT-0603R: Supplier: LCSC; Manufacturer: null; Supplier Part: C2286; JLCPCB Part Class: Basic Part
R1-R3 R5 R6 = 0603WAF1001T5E: Supplier: LCSC; Manufacturer: UNI-ROYAL(厚声); Supplier Part: C21190; Resistance (Ohms): 1K; JLCPCB Part Class: Basic Part
DPOARN1 DPOARN2 = 4D03WGJ0103T5E: Supplier: LCSC; Manufacturer: UNI-ROYAL(厚声); Supplier Part: C29718; JLCPCB Part Class: Basic Part
DPOAU1 = ULN2003ADR: Supplier: LCSC; Manufacturer: TI(德州仪器); Supplier Part: C7512; JLCPCB Part Class: Basic Part
SPAREQ1 STRTQ1 = AO3400A: Supplier: LCSC; Manufacturer: AOS; Supplier Part: C20917; JLCPCB Part Class: Basic Part; link: https://lcsc.com/eda_search?q=C20917&%26type=1&ref=editor
SPARER1 = 0603WAF4701T5E: Supplier: LCSC; Manufacturer: UNI-ROYAL(厚声); Supplier Part: C23162; JLCPCB Part Class: Basic Part; link: https://lcsc.com/eda_search?q=C23162&%26type=1&ref=editor
STRTD13 = MRA4007T3G: Supplier: LCSC; Manufacturer: ON; Supplier Part: C47921; JLCPCB Part Class: Extended Part
STRTQ8 = AOD4185_C879147: Supplier: LCSC; Supplier Part: C879147; Manufacturer: VBsemi Elec; Manufacturer Part: AOD4185; Contributor: LCSC; JLCPCB Part Class: Extended Part
STRTR1 = 0402WGF1001TCE: Supplier: LCSC; Manufacturer: UniOhm; Supplier Part: C11702; Resistance (Ohms): 1K; JLCPCB Part Class: Basic Part
SDCARD1 = TF-014-H16: Contributor: LCSC; Supplier: LCSC; Supplier Part: C2874208; Manufacturer: HANBO(汉博); JLCPCB Part Class: Extended Part
SDR1 = 0603WAF3302T5E: Supplier: LCSC; Manufacturer: UNI-ROYAL(厚声); Supplier Part: C4216; JLCPCB Part Class: Basic Part

## Nets
+3.3V: BRAINH1.29 DRVAU1.23(VCCB) DRVAU1.24(VCCB) DRVBU1.23(VCCB) DRVBU1.24(VCCB) ETBR1.1 ETBU1.2(VSO) SDC1.1 SDC2.1 SDCARD1.4(VDD) SDR1.2
+5V: AVIAC2.1 AVIAD1.3 AVIAD2.3 AVIAU1.4(VCC) BRAINH2.11 C1.2 CKPC2.2 CKPC3.1 CKPR6.2 CKPR7.2 CKPU1.10(VCC) CN1.2 DRVAU1.1(VCCA) DRVBU1.1(VCCA) HALLR1.2 HALLR2.2 HALLU1.5(VCC) KNOCKC1.1 KNOCKR6.2 KNOCKU1.5(V+) KNOCKU2.5(V+) STARTR1.1 STARTR2.2 U2.28 U3.2(VS)
GND: AVIAC1.1 AVIAC2.2 AVIAC4.1 AVIAC6.1 AVIAC26.1 AVIAR1.1 AVIAR4.1 AVIAR5.1 AVIAR7.1 AVIAR9.1 AVIAR11.1 AVIAR13.1 AVIAR15.1 AVIAU1.11(GND) BRAINH1.15 BRAINH1.16 BRAINH2.13 BRAINH2.14 C1.1 DPOARN1.1 DPOARN1.2 DPOARN1.3 DPOARN1.4 DPOARN2.1 DPOARN2.2 DPOARN2.3 DPOARN2.4 DPOAU1.8(E) DRVAU1.2(DIR) DRVAU1.11(GND) DRVAU1.12(GND) DRVAU1.13(GND) DRVAU1.22(OE#) DRVBU1.2(DIR) DRVBU1.11(GND) DRVBU1.12(GND) DRVBU1.13(GND) DRVBU1.22(OE#) ETBC1.2 ETBC2.2 ETBC3.2 ETBC4.2 ETBC5.2 ETBC6.1 ETBC7.1 ETBC8.1 ETBC9.1 ETBC10.2 ETBC11.1 ETBC12.2 ETBC13.1 ETBU1.6(GND) ETBU1.8(SI) ETBU1.9(CSN) ETBU1.10(SCK) ETBU1.13(EP) HALLC1.1 HALLC2.1 HALLU1.2(GND) IGNAD1.2(A) IGNALED2.2(K) IGNAQ2.3(E) IGNBD1.2(A) IGNBLED2.2(K) IGNBQ2.3(E) INJAC1.1 INJAD1.1(K) INJAQ1.3(S) INJBC1.1 INJBD1.1(K) INJBQ1.3(S) INJCC1.1 INJCD1.1(K) INJCQ1.3(S) INJDC1.1 INJDD1.1(K) INJDQ1.3(S) K4.85 LED1.2(K) LED2.2(K) LED3.2(K) LED5.2(K) LED6.2(K) SDC1.2 SDC2.2 SDCARD1.6(VSS) SDCARD1.9 SDCARD1.12 SPAREC1.1 SPAREQ1.2(S) SPARER1.1 STARTC1.1 STARTC2.1 STARTD2.2(A) STARTR3.1 STARTR5.1 STRTD13.2(A) STRTQ1.2(S) STRTR2.1 U1.1 U3.3(GND) U4.3
GNDA: BRAINH3.6 CKPC2.1 CKPC3.2 CKPU1.4(BIAS) CKPU1.5(GND) CKPU1.6(ZERO_EN) CKPU1.9(INT_THRS) CN1.1 KNOCKC1.2 KNOCKC4.2 KNOCKC5.1 KNOCKC6.1 KNOCKR7.1 KNOCKR9.1 KNOCKU1.2(GND) KNOCKU2.2(GND) U2.29
VSS: HALLR1.1 HALLR6.1 J2.1
AIR_TEMPERATURE_SENSOR: BRAINH1.12 U2.24
AVI2_TVS: AVIAC1.2 AVIAD1.1 AVIAR1.2 AVIAR8.1 AVIAU1.5(IN2+)
AVI3_TVS: AVIAC4.2 AVIAD2.2 AVIAR9.2 AVIAR12.1 AVIAU1.10(IN3+)
AVI4_TVS: AVIAC6.2 AVIAD2.1 AVIAR13.2 AVIAR16.1 AVIAU1.12(IN4+)
AVI_TVS: AVIAC26.2 AVIAD1.2 AVIAR6.1 AVIAR7.2 AVIAU1.3(IN1+)
BOOST_CONTROL: DPOAU1.12(5C) DPOAU1.13(4C) U2.17
CAN_HIGH: BRAINH2.7 U2.16 U4.5
CAN_LOW: BRAINH2.9 U2.15 U4.4
CKP+: CKPR4.1 U2.12
CKP-: CKPR1.1 U2.11
CLUTCH_SWITCH: BRAINH2.12 CN1.11
CMP: HALLR2.1 HALLR5.1 J2.2
COIL1: IGNAQ2.4(C) U2.9
COIL2: IGNBQ2.4(C) U2.8
CONSTANT_12V: K4.30 U1.2
COOLANT_TEMPERATURE_SENSOR: BRAINH1.11 U2.23
DRV_BOOST: DPOARN1.5 DPOAU1.4(4B) DPOAU1.5(5B) DRVBR4.1
DRV_FAN: DPOARN1.8 DPOAU1.1(1B) DRVBR1.1
DRV_FAN2: DPOARN1.7 DPOAU1.2(2B) DRVBR2.1
DRV_FPUMP: DPOARN1.6 DPOAU1.3(3B) DRVBR3.1
DRV_IGN1: DRVAR5.1 IGNAD1.1(C) IGNAR7.1 IGNAR8.2
DRV_IGN2: DRVAR6.1 IGNBD1.1(C) IGNBR7.1 IGNBR8.2
DRV_IGN3: DRVAR7.1 J1.1
DRV_IGN4: DRVAR8.1 J1.2
DRV_INJ1: DRVAR1.1 INJAQ1.1(G)
DRV_INJ2: DRVAR2.1 INJBQ1.1(G)
DRV_INJ3: DRVAR3.1 INJCQ1.1(G)
DRV_INJ4: DRVAR4.1 INJDQ1.1(G)
DRV_OPEN: DPOARN2.6 DPOAU1.6(6B) DRVBR7.1
DRV_START: DRVBR6.1
DRV_TACH: DPOARN2.5 DPOAU1.7(7B) DRVBR8.1
ETB+: CN1.10 ETBC13.2 ETBU1.7(OUT2)
ETB-: CN1.9 ETBC12.1 ETBU1.5(OUT1)
ETB_PWR: BRAINH2.19 CN2.2 DPOAR8.2 DPOAU1.9(COM) ETBC1.1 ETBC2.1 ETBC3.1 ETBC4.1 ETBC5.1 ETBC6.2 ETBC7.2 ETBC8.2 ETBC9.2 ETBC10.1 ETBC11.2 ETBU1.4(VS) F4.3 F4.4 INJAR1.1 INJBR1.1 INJCR1.1 INJDR1.1 K1.1 K1.3 K2.1 K2.3 K5.1 K5.3 K6.1 K6.3 R3.1 STRTLED1.2(A) STRTQ8.3(S) STRTR3.2 U2.18 U2.26 U2.27 U4.2
Fan1Ctrl: DPOAU1.16(1C) K5.2
FAN2_REAL: F1.3 F1.4 R1.1 U2.6
FAN2Ctrl: K1.2
Fan2Ctrl: DPOAU1.15(2C)
FAN_REAL: F5.3 F5.4 R5.1 U2.5
FLEX_FUEL: BRAINH1.9 CN1.12
FpumpCTRL: K6.2
FpumpCtrl: DPOAU1.14(3C)
FUEL_PUMP_REAL: F6.3 F6.4 R6.1 U2.7
INJ1: INJAC1.2 INJAD1.2(A) INJALED1.1(K) INJAQ1.2(D) U2.4
INJ2: INJBC1.2 INJBD1.2(A) INJBLED1.1(K) INJBQ1.2(D) U2.3
INJ3: INJCC1.2 INJCD1.2(A) INJCLED1.1(K) INJCQ1.2(D) U2.2
INJ4: INJDC1.2 INJDD1.2(A) INJDLED1.1(K) INJDQ1.2(D) U2.1
KEY12V: K4.86 U2.14
KNOCK: KNOCKC2.1 U2.13
MANIFOLD_PRESSURE_SENSOR: BRAINH1.18 U3.4(VOUT)
O2_SENSOR: BRAINH1.20 U2.22
OIL_PRESSURE_SENSOR: AVIAR6.2 CN1.4
OIL_PUMP_REAL: F2.3 F2.4 R2.1 U2.10
OP_CTRL: DPOAU1.11(6C) K2.2
PA5: AVIAR14.1 AVIAR15.2 BRAINH2.20
PC4: AVIAR10.1 AVIAR11.2 BRAINH1.3
PC5: AVIAR2.1 AVIAR4.2 BRAINH1.5
PC6: BRAINH1.2 ETBU1.12(PWM)
PC10: BRAINH2.2
PC11: BRAINH2.4
PD2: BRAINH3.2
PD3: BRAINH3.1
PD4: BRAINH2.1 HALLR4.1
PD10: BRAINH1.24 DRVBU1.15(B7)
PD11: BRAINH1.30 DRVBU1.16(B6)
PD12: BRAINH1.28
PD13: BRAINH1.26 SPAREQ1.1(G) SPARER1.2
PE11: BRAINH1.14 STARTC2.2 STARTD2.1(C) STARTR4.1
PE12: BRAINH1.13 STRTQ1.1(G) STRTR2.2
PE14: BRAINH3.10
PPSA: AVIAR12.2 CN1.5
PPSB: AVIAR8.2 CN1.7
SPARE: CN1.3 SPAREC1.2 SPAREQ1.3(D)
SPI1_CS: BRAINH2.3 SDCARD1.2(CD/DAT3)
SPI1_MISO: BRAINH2.15 SDCARD1.7(DAT0) SDR1.1
SPI1_MOSI: BRAINH2.5 SDCARD1.3(CMD)
SPI1_SCK: BRAINH2.17 SDCARD1.5(CLX)
STARTER_OUT: STRTD13.1(C) STRTQ8.2(D) U2.25
STARTER_REQUEST: STARTC1.2 STARTLED1.2(K) STARTR2.1 STARTR3.2 STARTR4.2 U2.20
StepDir: BRAINH1.25
STEPDIR: ETBR1.2 ETBU1.11(DIS)
StepStep: BRAINH1.23
STEPSTEP: ETBU1.1(DIR)
STM32__BOOST: BRAINH3.3 DRVBU1.17(B5) DRVBU1.18(B4)
STM32__CAM: BRAINH1.8 HALLR3.2
STM32__CRANK: BRAINH1.10 CKPLED1.1(C) CKPR6.1 CKPU1.7(COUT)
STM32__FAN: BRAINH3.8 DRVBU1.21(B1)
STM32__FUEL_PUMP: BRAINH3.5 DRVBU1.19(B3)
STM32__IDLE: BRAINH3.9
STM32__IGN1: BRAINH1.21 DRVAU1.17(B5)
STM32__IGN2: BRAINH1.22 DRVAU1.16(B6)
STM32__IGN3: BRAINH1.6 DRVAU1.15(B7)
STM32__IGN4: BRAINH1.4 DRVAU1.14(B8)
STM32__INJ1: BRAINH2.18 DRVAU1.21(B1)
STM32__INJ2: BRAINH2.16 DRVAU1.20(B2)
STM32__INJ3: BRAINH1.27 DRVAU1.19(B3)
STM32__INJ4: BRAINH2.6 DRVAU1.18(B4)
STM32__KNOCK: BRAINH1.1 KNOCKR8.1 KNOCKR9.2
STM32__NOS: BRAINH3.7 DRVBU1.20(B2)
STM32__O2B: AVIAR3.1 AVIAR5.2 BRAINH1.19
STM32__TACH: BRAINH3.4 DRVBU1.14(B8)
TACHO_OUT: DPOAR8.1 DPOAU1.10(7C) U2.21
thres-in: BRAINH1.7
THROTTLE_POSITION_SENSOR: BRAINH1.17 CN1.8 U2.19
TPSB: AVIAR16.2 CN1.6
USART_RX: BRAINH2.8 J5.2
USART_TX: BRAINH2.10 J5.1
VREF2: KNOCKC6.2 KNOCKR6.1 KNOCKR7.2 KNOCKU1.1(+)
WBO_HTR: CN2.6 U2.34
WBO_IP: CN2.3 U2.31
WBO_RTRIM: CN2.4 U2.30
WBO_UN: CN2.1 U2.33
WBO_VM: CN2.5 U2.32
Net-(AVIAR2-2): AVIAR2.2 AVIAU1.6(IN2-) AVIAU1.7(OUT2)
Net-(AVIAR3-2): AVIAR3.2 AVIAU1.1(OUT1) AVIAU1.2(IN1-)
Net-(AVIAR10-2): AVIAR10.2 AVIAU1.8(OUT3) AVIAU1.9(IN3-)
Net-(AVIAR14-2): AVIAR14.2 AVIAU1.13(IN4-) AVIAU1.14(OUT4)
Net-(CKPC1-1): CKPC1.1 CKPR2.2 CKPR5.1 CKPU1.2(IN-)
Net-(CKPC1-2): CKPC1.2 CKPR3.2 CKPR5.2 CKPU1.1(IN+)
Net-(CKPLED1-2): CKPLED1.2(A) CKPR7.1
Net-(CKPR1-2): CKPR1.2 CKPR2.1
Net-(CKPR3-1): CKPR3.1 CKPR4.2
Net-(DRVAR1-2): DRVAR1.2 DRVAU1.3(A1)
Net-(DRVAR2-2): DRVAR2.2 DRVAU1.4(A2)
Net-(DRVAR3-2): DRVAR3.2 DRVAU1.5(A3)
Net-(DRVAR4-2): DRVAR4.2 DRVAU1.6(A4)
Net-(DRVAR5-2): DRVAR5.2 DRVAU1.7(A5)
Net-(DRVAR6-2): DRVAR6.2 DRVAU1.8(A6)
Net-(DRVAR7-2): DRVAR7.2 DRVAU1.9(A7)
Net-(DRVAR8-2): DRVAR8.2 DRVAU1.10(A8)
Net-(DRVBR1-2): DRVBR1.2 DRVBU1.3(A1)
Net-(DRVBR2-2): DRVBR2.2 DRVBU1.4(A2)
Net-(DRVBR3-2): DRVBR3.2 DRVBU1.5(A3)
Net-(DRVBR4-2): DRVBR4.2 DRVBU1.6(A4) DRVBU1.7(A5)
Net-(DRVBR6-2): DRVBR6.2 DRVBU1.8(A6)
Net-(DRVBR7-2): DRVBR7.2 DRVBU1.9(A7)
Net-(DRVBR8-2): DRVBR8.2 DRVBU1.10(A8)
Net-(F1-1): F1.1 F1.2 K1.5
Net-(F2-1): F2.1 F2.2 K2.5
Net-(F4-1): F4.1 F4.2 K4.87
Net-(F5-1): F5.1 F5.2 K5.5
Net-(F6-1): F6.1 F6.2 K6.5
Net-(HALLC1-2): HALLC1.2 HALLR6.2 HALLR8.1 HALLU1.1(1A)
Net-(HALLC2-2): HALLC2.2 HALLR5.2 HALLR7.2 HALLU1.3(2A)
Net-(HALLR3-1): HALLR3.1 HALLR7.1 HALLU1.4(2Y)
Net-(HALLR4-2): HALLR4.2 HALLR8.2 HALLU1.6(1Y)
Net-(IGNALED2-1): IGNALED2.1(A) IGNAR8.1
Net-(IGNAQ2-1): IGNAQ2.1(G) IGNAR7.2
Net-(IGNBLED2-1): IGNBLED2.1(A) IGNBR8.1
Net-(IGNBQ2-1): IGNBQ2.1(G) IGNBR7.2
Net-(INJALED1-2): INJALED1.2(A) INJAR1.2
Net-(INJBLED1-2): INJBLED1.2(A) INJBR1.2
Net-(INJCLED1-2): INJCLED1.2(A) INJCR1.2
Net-(INJDLED1-2): INJDLED1.2(A) INJDR1.2
Net-(KNOCKC2-2): KNOCKC2.2 KNOCKR5.1
Net-(KNOCKC3-1): KNOCKC3.1 KNOCKR2.2 KNOCKR4.1
Net-(KNOCKC3-2): KNOCKC3.2 KNOCKR8.2 KNOCKU2.3(-) KNOCKU2.4(OUT)
Net-(KNOCKC4-1): KNOCKC4.1 KNOCKR4.2 KNOCKU2.1(+)
Net-(KNOCKC5-2): KNOCKC5.2 KNOCKR2.1 KNOCKR3.2
Net-(KNOCKR1-1): KNOCKR1.1 KNOCKR5.2 KNOCKU1.3(-)
Net-(KNOCKR1-2): KNOCKR1.2 KNOCKR3.1 KNOCKU1.4(OUT)
Net-(LED1-1): LED1.1(A) R1.2
Net-(LED2-1): LED2.1(A) R2.2
Net-(LED3-1): LED3.1(A) R3.2
Net-(LED5-1): LED5.1(A) R5.2
Net-(LED6-1): LED6.1(A) R6.2
Net-(STARTLED1-1): STARTLED1.1(A) STARTR1.2 STARTR5.2
Net-(STRTLED1-1): STRTLED1.1(K) STRTR1.2
Net-(STRTQ1-3): STRTQ1.3(D) STRTQ8.1(G) STRTR1.1 STRTR3.1

Not connected (* = marked no-connect by the designer): CKPU1 3(NC)* 8(EXT)*; DPOARN2 7 8*; ETBU1 3(SO)*; K1 4; K2 4; K5 4; K6 4; SDCARD1 1(DAT2)* 8(DAT1)* 10* 11*; U3 1(DNC)* 5(DNC)* 6(DNC)* 7(DNC)* 8(DNC)*; U4 1

## Notes on the sheets
sheet 1
- PA3 - KNOCK
  PA5 - TPS2
  PB0 - O2/2
  PB3 - SCK
  PB4 - MISO
  PB5 - MOSI
  PB6 - CS
  PB14 - ETB_DIS/STEPDIR
  PB15 - ETB_DIR/STEPSTEP
  PC4 - PPS
  PC5 - PPS2
  PC6 - ETB PWM
  PC10 - VVT1
  PC11 - VVT2
  PD0 - CAN/RX
  PD1 - CAN/TX
  PD2 - IGN7
  PD3 - IGN8
  PD4 - CMP2
  PD5 - USART/TX
  PD6 - USART/RX
  PD10 - INJ5
  PD11 - INJ6
  PD12 - INJ7
  PD13 - INJ8
  PD14 - DAC
  PE11 - IGN5
  PE12 - IGN6
- Green Two Screw
- Injectors,
  smart ignition,
  crank need conditioning
sheet 2
- MREL
- 40a
- 40a
- 40a
- 40a
- 40a
sheet 3
- Igniter
- Igniter
sheet 4
- Injector Driver
- Injector Driver
- BLUE
- BLUE
- Injector Driver
- Injector Driver
- BLUE
- BLUE
sheet 5
- DPI
- EMERALD
- PA3 - KNOCK
  PA5 - TPS2
  PB0 - O2/2
  PB3 - SCK
  PB4 - MISO
  PB5 - MOSI
  PB6 - CS
  PB14 - ETB_DIS/STEPDIR
  PB15 - ETB_DIR/STEPSTEP
  PC4 - PPS
  PC5 - PPS2
  PC6 - ETB PWM
  PC10 - VVT1
  PC11 - VVT2
  PD0 - CAN/RX
  PD1 - CAN/TX
  PD2 - IGN7
  PD3 - IGN8
  PD4 - CMP2
  PD5 - USART/TX
  PD6 - USART/RX
  PD10 - INJ5
  PD11 - INJ6
  PD12 - INJ7
  PD13 - INJ8
  PD14 - DAC
  PE11 - IGN5
  PE12 - IGN6
sheet 6
- LowPowerGND
- 12V HC Out
sheet 7
- PA3 - KNOCK
  PA5 - TPS2
  PB0 - O2/2
  PB3 - SCK
  PB4 - MISO
  PB5 - MOSI
  PB6 - CS
  PB14 - ETB_DIS/STEPDIR
  PB15 - ETB_DIR/STEPSTEP
  PC4 - PPS
  PC5 - PPS2
  PC6 - ETB PWM
  PC10 - VVT1
  PC11 - VVT2
  PD0 - CAN/RX
  PD1 - CAN/TX
  PD2 - IGN7
  PD3 - IGN8
  PD4 - CMP2
  PD5 - USART/TX
  PD6 - USART/RX
  PD10 - INJ5
  PD11 - INJ6
  PD12 - INJ7
  PD13 - INJ8
  PD14 - DAC
  PE11 - IGN5
  PE12 - IGN6
sheet 8
- PA3 - KNOCK
  PA5 - TPS2
  PB0 - O2/2
  PB3 - SCK
  PB4 - MISO
  PB5 - MOSI
  PB6 - CS
  PB14 - ETB_DIS/STEPDIR
  PB15 - ETB_DIR/STEPSTEP
  PC4 - PPS
  PC5 - PPS2
  PC6 - ETB PWM
  PC10 - VVT1
  PC11 - VVT2
  PD0 - CAN/RX
  PD1 - CAN/TX
  PD2 - IGN7
  PD3 - IGN8
  PD4 - CMP2
  PD5 - USART/TX
  PD6 - USART/RX
  PD10 - INJ5
  PD11 - INJ6
  PD12 - INJ7
  PD13 - INJ8
  PD14 - DAC
  PE11 - IGN5
  PE12 - IGN6
sheet 9
- MAX9924 Based VR Converter
sheet 11
- KNOCK
sheet 12
- PA3 - KNOCK
  PA5 - TPS2
  PB0 - O2/2
  PB3 - SCK
  PB4 - MISO
  PB5 - MOSI
  PB6 - CS
  PB14 - ETB_DIS/STEPDIR
  PB15 - ETB_DIR/STEPSTEP
  PC4 - PPS
  PC5 - PPS2
  PC6 - ETB PWM
  PC10 - VVT1
  PC11 - VVT2
  PD0 - CAN/RX
  PD1 - CAN/TX
  PD2 - IGN7
  PD3 - IGN8
  PD4 - CMP2
  PD5 - USART/TX
  PD6 - USART/RX
  PD10 - INJ5
  PD11 - INJ6
  PD12 - INJ7
  PD13 - INJ8
  PD14 - DAC
  PE11 - IGN5
  PE12 - IGN6
